# Altium project TE0723.PrjPCB (part 1 of 2)
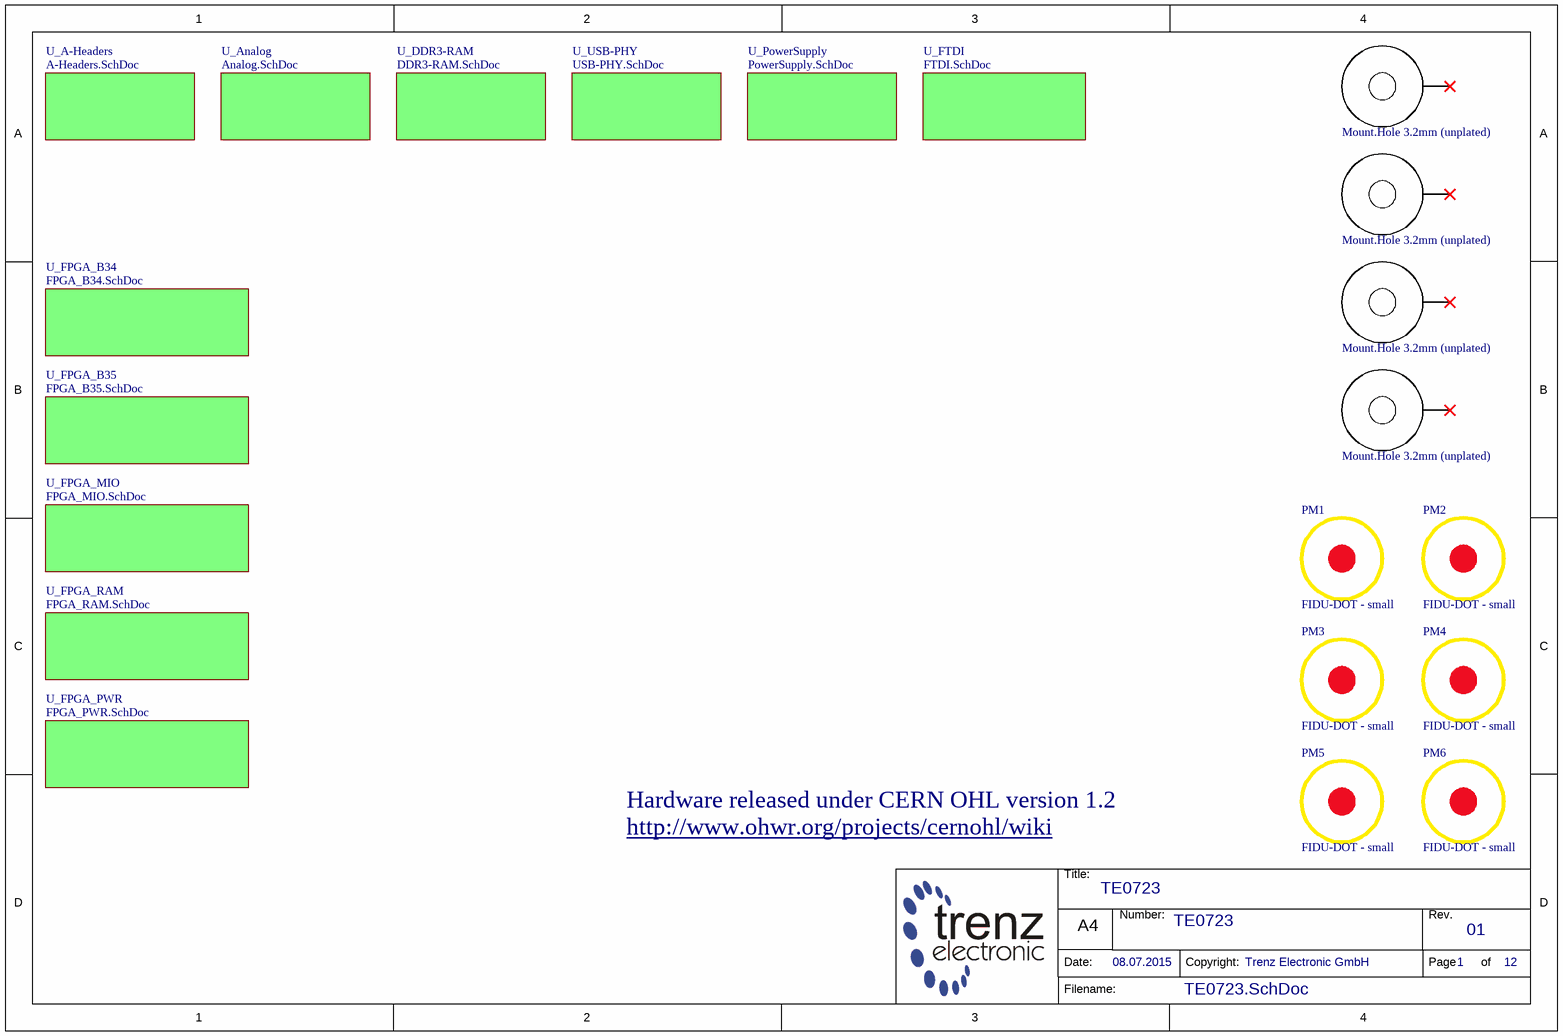
[diagram p0: TE0723.SchDoc]
12 sheets, 204 parts. Net scope: global (net labels, ports and power ports of the same name join across sheets).
Board file: TE0723.PcbDoc
Sheets:
  TE0723.SchDoc
    U_A-Headers = A-Headers.SchDoc
    U_Analog = Analog.SchDoc
    U_DDR3-RAM = DDR3-RAM.SchDoc
    U_FPGA_B34 = FPGA_B34.SchDoc
    U_FPGA_B35 = FPGA_B35.SchDoc
    U_FPGA_MIO = FPGA_MIO.SchDoc
    U_FPGA_PWR = FPGA_PWR.SchDoc
    U_FPGA_RAM = FPGA_RAM.SchDoc
    U_FTDI = FTDI.SchDoc
    U_PowerSupply = PowerSupply.SchDoc
    U_USB-PHY = USB-PHY.SchDoc

## Sheet TE0723.SchDoc: TE0723
size A4; Organization: Trenz Electronic GmbH; DocumentNumber: TE0723; Revision: 01; SheetNumber: 1; SheetTotal: 12; Date: 08.07.2015; Author: Indrek Tubalkain; CompanyName: Trenz Electronic GmbH; DrawnBy: Indrek Tubalkain; Engineer: Indrek Tubalkain; ProjectName: TE0723 Arduino

### Parts
H1  Mount.Hole 3.2mm (unplated)  [MHole3_2mm-UNPLATED]  (no BOM)
H2  Mount.Hole 3.2mm (unplated)  [MHole3_2mm-UNPLATED]  (no BOM)
H3  Mount.Hole 3.2mm (unplated)  [MHole3_2mm-UNPLATED]  (no BOM)
H4  Mount.Hole 3.2mm (unplated)  [MHole3_2mm-UNPLATED]  (no BOM)
PM1  FIDU-DOT - small  [FIDU-DOT - small]
PM2  FIDU-DOT - small  [FIDU-DOT - small]
PM3  FIDU-DOT - small  [FIDU-DOT - small]
PM4  FIDU-DOT - small  [FIDU-DOT - small]
PM5  FIDU-DOT - small  [FIDU-DOT - small]
PM6  FIDU-DOT - small  [FIDU-DOT - small]

### Sub-sheets
U_A-Headers = A-Headers.SchDoc: no entries
U_Analog = Analog.SchDoc: no entries
U_DDR3-RAM = DDR3-RAM.SchDoc: no entries
U_FPGA_B34 = FPGA_B34.SchDoc: no entries
U_FPGA_B35 = FPGA_B35.SchDoc: no entries
U_FPGA_MIO = FPGA_MIO.SchDoc: no entries
U_FPGA_PWR = FPGA_PWR.SchDoc: no entries
U_FPGA_RAM = FPGA_RAM.SchDoc: no entries
U_FTDI = FTDI.SchDoc: no entries
U_PowerSupply = PowerSupply.SchDoc: no entries
U_USB-PHY = USB-PHY.SchDoc: no entries

### Nets

Not connected (* = marked no-connect by the designer): H1 1*; H2 1*; H3 1*; H4 1*

### Notes on the sheet
- Hardware released under CERN OHL version 1.2
- http://www.ohwr.org/projects/cernohl/wiki
- Title:
- Number:
- Rev.
- Date:
- A4
- Copyright:
- Page
- of
- Filename:

### Library data of the parts
H1-H4 = 24910: AN: 24910; Mixed: THT
PM1-PM6 = 22905: AN: 22905; Mixed: FIDU

## Sheet A-Headers.SchDoc: TE0723 - Connectors
size A4; Organization: Trenz Electronic GmbH; DocumentNumber: TE0723; Revision: 01; SheetNumber: 12; SheetTotal: 12; Date: 08.07.2015; Author: Indrek Tubalkain; CompanyName: Trenz Electronic GmbH; DrawnBy: Indrek Tubalkain; Engineer: Indrek Tubalkain; ProjectName: TE0723 Arduino
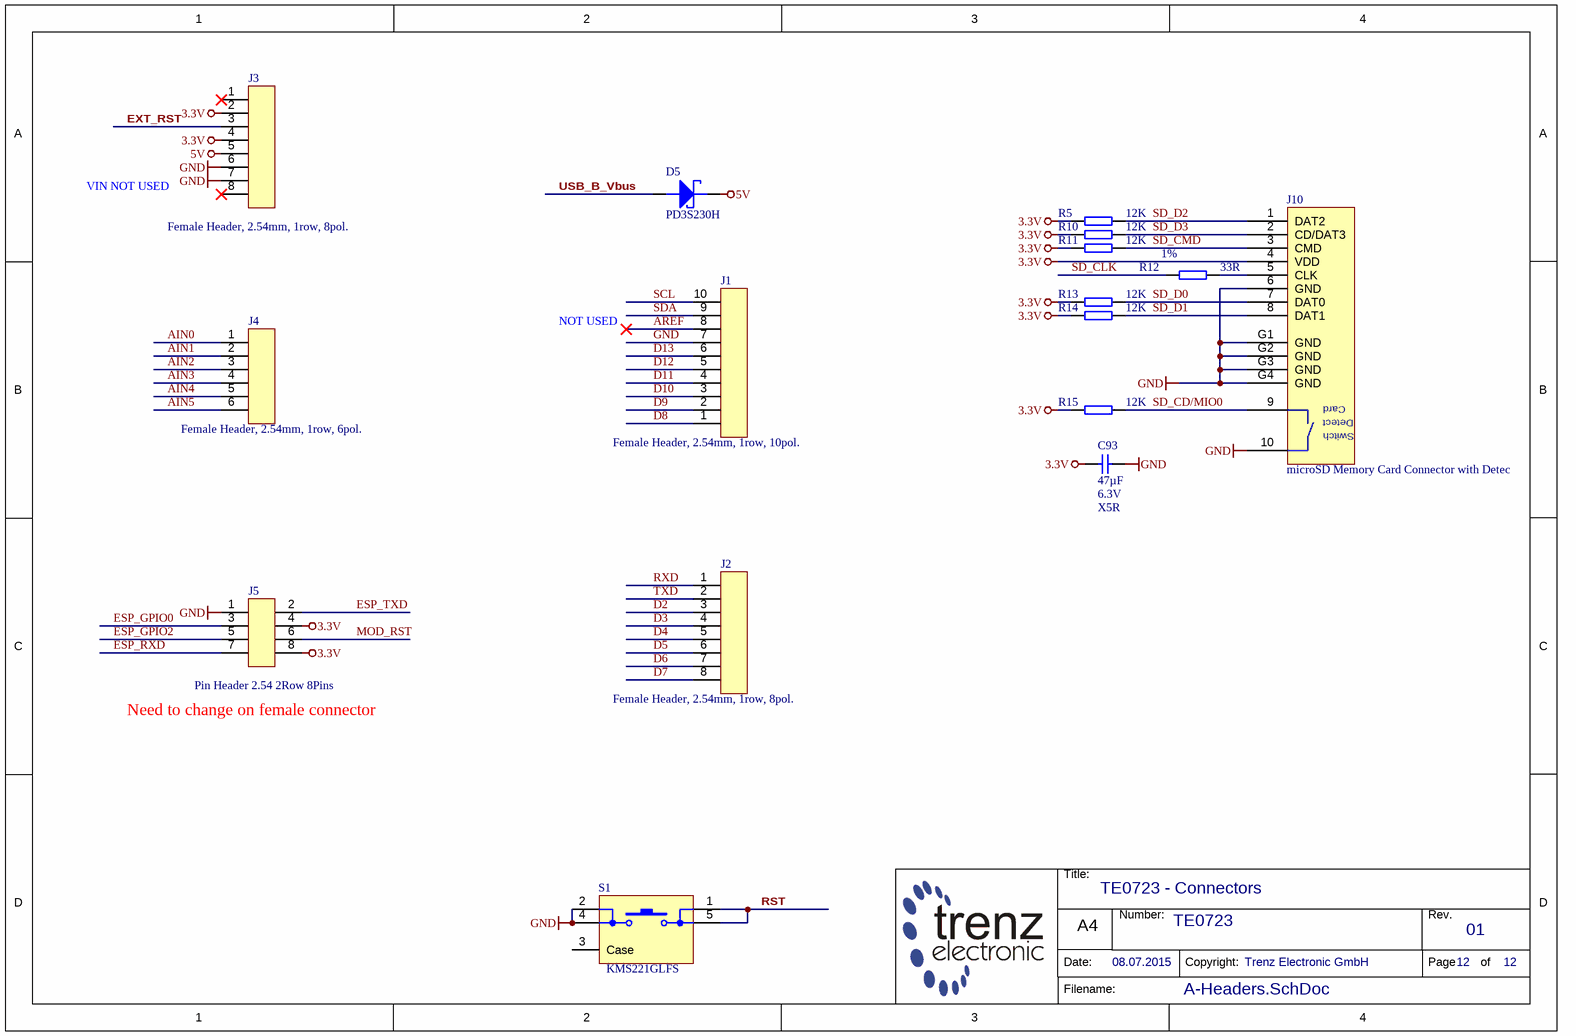
[diagram p1: A-Headers.SchDoc]

### Parts
C93  47µF  Voltage: 6.3V  Technology: X5R  [CAPC2012X135N]
D5  PD3S230H  [PowerDI323]
J1  Female Header, 2.54mm, 1row, 10pol.  [BUCHSENLEISTE-2.54-10-1R]
J2  Female Header, 2.54mm, 1row, 8pol.  [BUCHSENLEISTE-2.54-8-1R]
J3  Female Header, 2.54mm, 1row, 8pol.  [BUCHSENLEISTE-2.54-8-1R]
J4  Female Header, 2.54mm, 1row, 6pol.  [BUCHSENLEISTE-2.54-6-1R]
J5  Pin Header 2.54 2Row 8Pins  [STIFTLEISTE2_54 OG 2R-8]
J10  microSD Memory Card Connector with Detec  [104031-0811]
R5  12K  [RESC1005X40N]
R10  12K  [RESC1005X40N]
R11  12K  [RESC1005X40N]
R12  33R  Tolerance: 1%  [RESC0603X26N]
R13  12K  [RESC1005X40N]
R14  12K  [RESC1005X40N]
R15  12K  [RESC1005X40N]
S1  KMS221GLFS  [KMS2xxGLFS]

### Nets
3.3V: C93.1 J3.2 J3.4 J5.4 J5.8 J10.4(VDD) R5.1 R10.1 R11.1 R13.1 R14.1 R15.1
5V: D5.1(KATHODE) J3.5
GND: C93.2 J1.7 J3.6 J3.7 J5.1 J10.6(GND) J10.10(CDSW) J10.G1(GND) J10.G2(GND) J10.G3(GND) J10.G4(GND) S1.2 S1.4
AIN0: J4.1
AIN1: J4.2
AIN2: J4.3
AIN3: J4.4
AIN4: J4.5
AIN5: J4.6
AREF: J1.8
D2: J2.3
D3: J2.4
D4: J2.5
D5: J2.6
D6: J2.7
D7: J2.8
D8: J1.1
D9: J1.2
D10: J1.3
D11: J1.4
D12: J1.5
D13: J1.6
ESP_GPIO0: J5.3
ESP_GPIO2: J5.5
ESP_RXD: J5.7
ESP_TXD: J5.2
EXT_RST: J3.3
MOD_RST: J5.6
RST: S1.1 S1.5
RXD: J2.1
SCL: J1.10
SD_CD/MIO0: J10.9(CDSW) R15.2
SD_CLK: R12.1
SD_CMD: J10.3(CMD) R11.2
SD_D0: J10.7(DAT0) R13.2
SD_D1: J10.8(DAT1) R14.2
SD_D2: J10.1(DAT2) R5.2
SD_D3: J10.2(CD/DAT3) R10.2
SDA: J1.9
TXD: J2.2
USB_B_Vbus: D5.2(ANODE)
NetJ10_5: J10.5(CLK) R12.2

Not connected (* = marked no-connect by the designer): J3 1* 8*; S1 3(Case)

### Notes on the sheet
- VIN NOT USED
- NOT USED
- (near J5) Need to change on female connector
- Title:
- Number:
- Rev.
- Date:
- A4
- Copyright:
- Page
- of
- Filename:
- (in symbol 26322) Card; Detect; Switch

### Library data of the parts
C93 = 24718: KON 47µF 6,3V  X5R SMD 20%; AN: 24718; Mixed: SMT; Value: 47u; Preferred: Yes; Case: 2012 (0805); Tolerance: 20%
D5 = 24682: AN: 24682; Mixed: SMT; Case: PowerDI323; HelpURL: B:\AD\adlib\datasheet\PD3S230H
J1 = 26386: Buchsenleiste 1 reihig präz. 10 pol.; AN: 26386; Mixed: THT
J2 J3 = 26387: Buchsenleiste 1 reihig präz. 8 pol.; AN: 26387; Mixed: THT
J4 = 26388: Buchsenleiste 1 reihig präz. 6 pol.; AN: 26388; Mixed: THT
J5 = 23904: Stiftleiste gerade 2-reihig, 8pol.; AN: 23904; Mixed: THT; Trenz-Stock: Yes
J10 = 26322: microSD Memory Card Connector with Detect Switch; AN: 26322; Mixed: SMT; Trenz-Stock: Yes; Case: microSD; HelpURL: B:\AD\adlib\datasheet\104031-0811
R5 R10 R11 R13-R15 = 22598: WID SMD 12K 1% 0,063W; AN: 22598; Mixed: SMT; Preferred: Yes; Case: 1005 (0402); Value: 12K
R12 = 25021: WID SMD 33R 1% 0,05W; AN: 25021; Mixed: SMT; Value: 33; Preferred: Yes; Case: 0603 (0201); HelpURL: B:\AD\adlib\datasheet\R0201
S1 = 26229: KMS221GLFS - SWITCH, SPST, 0.05A, 32VDC, SMD; AN: 26229; Mixed: SMT; HelpURL: B:\AD\adlib\datasheet\KMS

## Sheet Analog.SchDoc: TE0723 - Analog Input
size A4; PageSetup: Record=PageOptions|CenterHorizontal=True|CenterVertical=True|PrintScale=0.96|XCorrection=1.00|YCorrection=1.00|PrintKind=0|BorderSize=5000000|LeftOffset=0|BottomOffset=0|Orientation=2|PaperLength=1000|PaperWidth=1000|Scale=100|PaperSource=7|PrintQuality=-4|MediaType=1|DitherType=10|PaperKind=A4|PrintScaleMode=1; Organization: Trenz Electronic GmbH; DocumentNumber: TE0723; Revision: 01; SheetNumber: 7; SheetTotal: 12; Date: 08.07.2015; Author: Indrek Tubalkain; CompanyName: Trenz Electronic GmbH; DrawnBy: Indrek Tubalkain; Engineer: Indrek Tubalkain; ProjectName: TE0723 Arduino
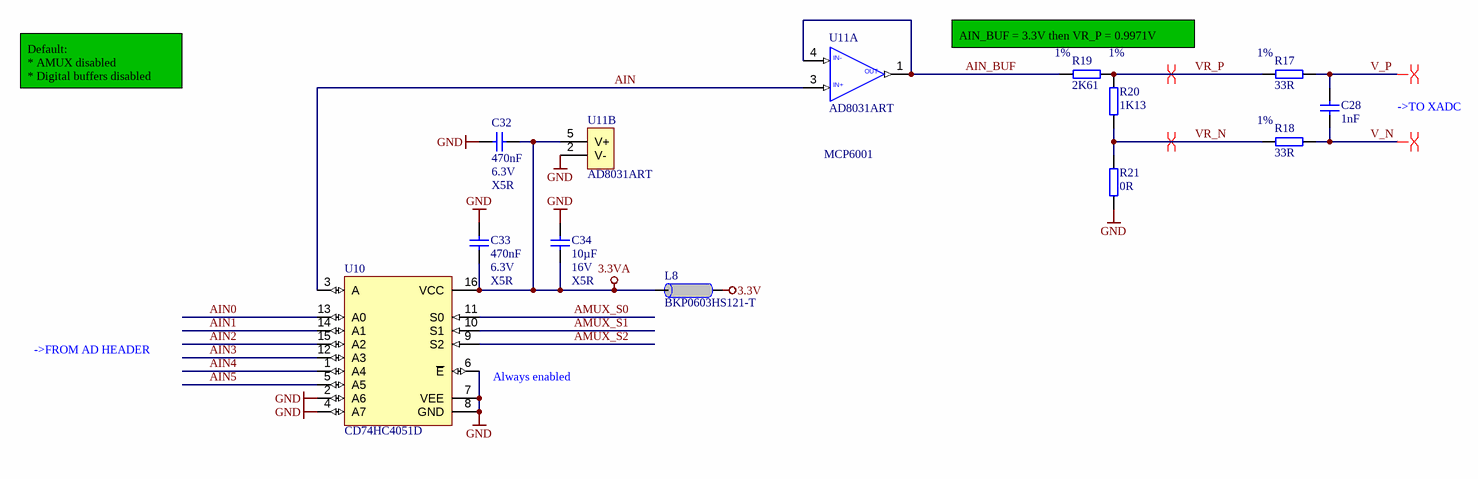
[diagram p2: Analog.SchDoc]

### Parts
C28  1nF  [CAPC1005X55N]
C32  470nF  Voltage: 6.3V  Technology: X5R  [CAPC0603X33N]
C33  470nF  Voltage: 6.3V  Technology: X5R  [CAPC0603X33N]
C34  10µF  Voltage: 16V  Technology: X5R  [CAPC1608X90N]
L8  BKP0603HS121-T  [INDC0603X33N]
R17  33R  Tolerance: 1%  [RESC0603X26N]
R18  33R  Tolerance: 1%  [RESC0603X26N]
R19  2K61  Tolerance: 1%  [RESC1005X40N]
R20  1K13  Tolerance: 1%  [RESC1005X40N]
R21  0R  [RESC1005X40N]
U10  CD74HC4051D  [SOIC127P600X175-16N]
U11  AD8031ART  [SOT95P280X145-5N]  (parts A,B of 2)

### Nets
3.3V: L8.1
3.3VA: C32.2 C33.1 C34.2 L8.2 U10.16(VCC) U11.5(V+)
GND: C32.1 C33.2 C34.1 R21.2 U10.2(A6) U10.4(A7) U10.6(~{E}) U10.7(VEE) U10.8(GND) U11.2(V-)
AIN: U10.3(A) U11.3(IN+)
AIN0: U10.13(A0)
AIN1: U10.14(A1)
AIN2: U10.15(A2)
AIN3: U10.12(A3)
AIN4: U10.1(A4)
AIN5: U10.5(A5)
AIN_BUF: R19.1 U11.1(OUT) U11.4(IN-)
AMUX_S0: U10.11(S0)
AMUX_S1: U10.10(S1)
AMUX_S2: U10.9(S2)
V_N: C28.2 R18.2
V_P: C28.1 R17.2
VR_N: R18.1 R20.2 R21.1
VR_P: R17.1 R19.2 R20.1

### Layout directives
differential pair: V_N, V_P, VR_N, VR_P

### Notes on the sheet
- AIN_BUF = 3.3V then VR_P = 0.9971V
- Default:
  * AMUX disabled
  * Digital buffers disabled
- ->TO XADC
- MCP6001
- ->FROM AD HEADER
- (near U10) Always enabled
- Title:
- Number:
- Rev.
- Date:
- A4
- Copyright:
- Page
- of
- Filename:

### Library data of the parts
C28 = 26184: KON 1nF 50V SMD AEC-Q200; AN: 26184; Tolerance: 10%; Mixed: SMT; Value: 1n; Case: 1005 (0402); Voltage: 50V; Technology: X7R
C32 C33 = 24921: KON 470nF X5R 6.3V SMD 20%; AN: 24921; Value: 470n; Mixed: SMT; Preferred: Yes; Case: 0603 (0201); Tolerance: 20%
C34 = 25341: KON 10µF 16V X5R SMD 20%; AN: 25341; Mixed: SMT; Value: 10u; Preferred: Yes; Case: 1608 (0603); Tolerance: 20%
L8 = 25393: Ferritdurchführung SMD 0201; AN: 25393; Mixed: SMT; Trenz-Stock: Yes; Tolerance: 25%; Case: 0603 (0201); HelpURL: B:\AD\adlib\datasheet\MULTILAYER CHIP BEAD INDUCTORS BK; Preferred: Yes
R17 R18 = 25021: as R12 on sheet A-Headers; Case: 0603 (0201); HelpURL: B:\AD\adlib\datasheet\R0201
R19 = 23730: WID SMD 2K61 1% 0,063W; AN: 23730; Mixed: SMT; Value: 2.61K; Preferred: Yes; Case: 1005 (0402)
R20 = 23160: WID SMD 1K13 1% 0,063W; AN: 23160; Mixed: SMT; Value: 1.13K; Preferred: Yes; Case: 1005 (0402)
R21 = 26222: WID SMD 0R 1% 0.063W AEC-Q200; AN: 26222; Mixed: SMT; Value: 0; Preferred: Yes; Case: 1005 (0402)
U10 = 26538: AN: 26538; Mixed: SMT; Trenz-Stock: Yes; Case: SOIC16 D (R-PDSO-G16); HelpURL: B:\AD\adlib\datasheet\74HCx4051
U11 = 25377: AN: 25377; Mixed: SMT; Trenz-Stock: Yes; Case: SOT23-5; HelpURL: B:\AD\adlib\datasheet\AD8031

## Sheet DDR3-RAM.SchDoc: TE0723 - DDR Memory
size A4; Organization: Trenz Electronic GmbH; DocumentNumber: TE0723; Revision: 01; SheetNumber: 8; SheetTotal: 12; Date: 08.07.2015; Author: Indrek Tubalkain; CompanyName: Trenz Electronic GmbH; DrawnBy: Indrek Tubalkain; Engineer: Indrek Tubalkain; ProjectName: TE0723 Arduino
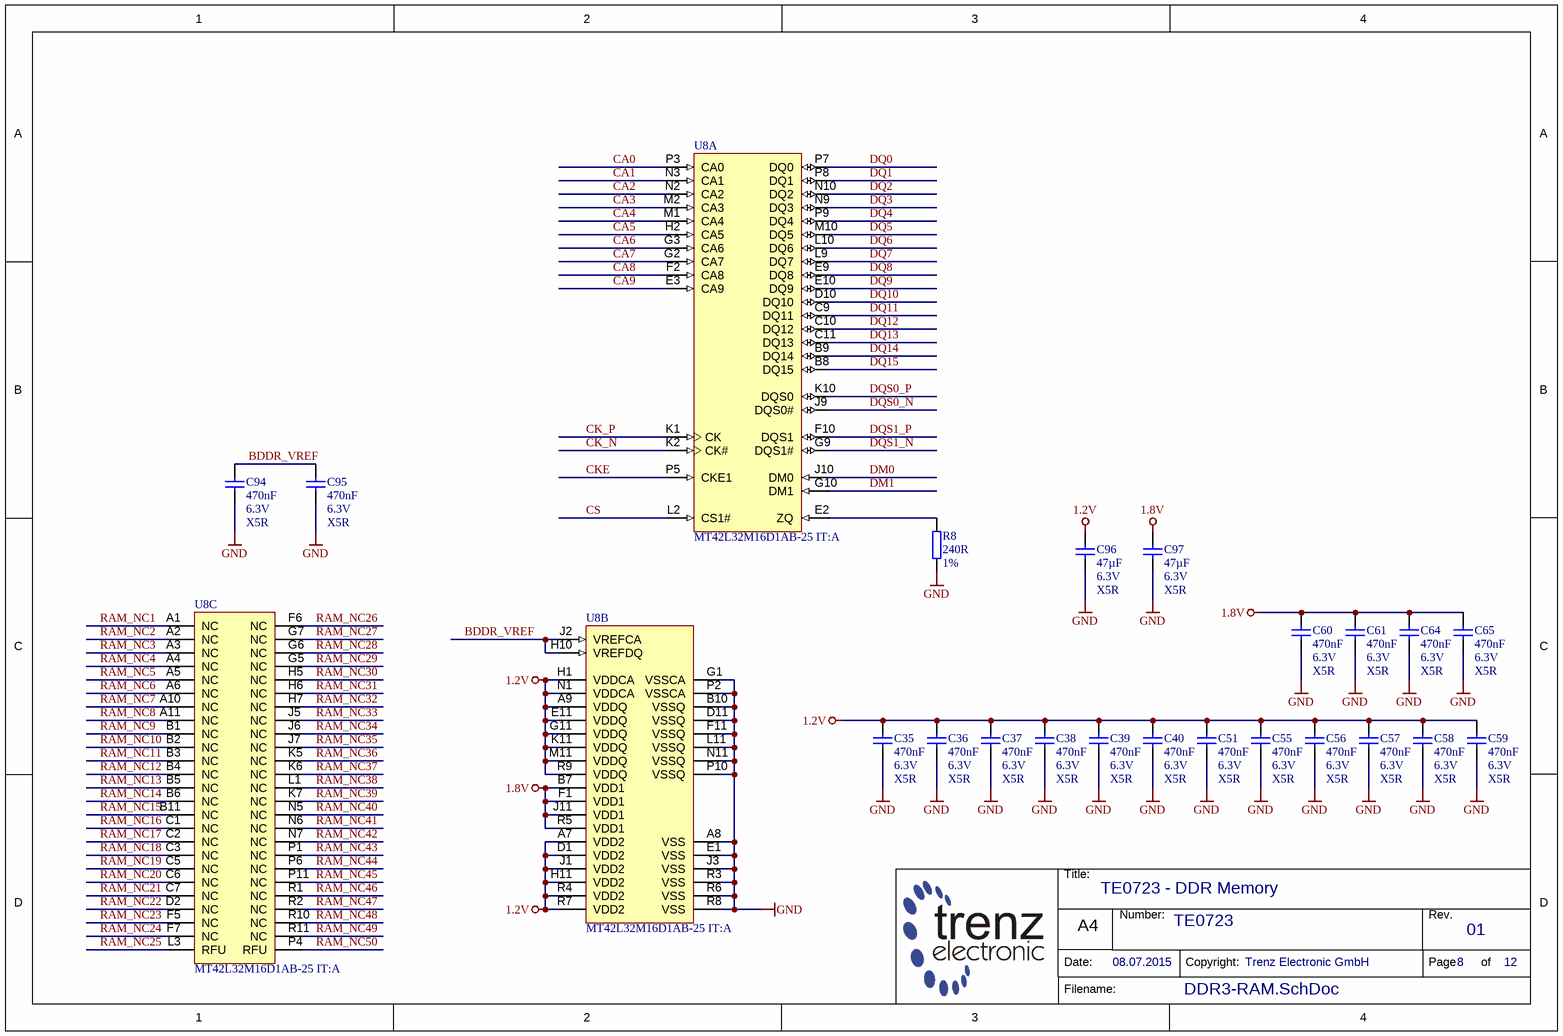
[diagram p3: DDR3-RAM.SchDoc]

### Parts
C35  470nF  Voltage: 6.3V  Technology: X5R  [CAPC0603X33N]
C36  470nF  Voltage: 6.3V  Technology: X5R  [CAPC0603X33N]
C37  470nF  Voltage: 6.3V  Technology: X5R  [CAPC0603X33N]
C38  470nF  Voltage: 6.3V  Technology: X5R  [CAPC0603X33N]
C39  470nF  Voltage: 6.3V  Technology: X5R  [CAPC0603X33N]
C40  470nF  Voltage: 6.3V  Technology: X5R  [CAPC0603X33N]
C51  470nF  Voltage: 6.3V  Technology: X5R  [CAPC0603X33N]
C55  470nF  Voltage: 6.3V  Technology: X5R  [CAPC0603X33N]
C56  470nF  Voltage: 6.3V  Technology: X5R  [CAPC0603X33N]
C57  470nF  Voltage: 6.3V  Technology: X5R  [CAPC0603X33N]
C58  470nF  Voltage: 6.3V  Technology: X5R  [CAPC0603X33N]
C59  470nF  Voltage: 6.3V  Technology: X5R  [CAPC0603X33N]
C60  470nF  Voltage: 6.3V  Technology: X5R  [CAPC0603X33N]
C61  470nF  Voltage: 6.3V  Technology: X5R  [CAPC0603X33N]
C64  470nF  Voltage: 6.3V  Technology: X5R  [CAPC0603X33N]
C65  470nF  Voltage: 6.3V  Technology: X5R  [CAPC0603X33N]
C94  470nF  Voltage: 6.3V  Technology: X5R  [CAPC0603X33N]
C95  470nF  Voltage: 6.3V  Technology: X5R  [CAPC0603X33N]
C96  47µF  Voltage: 6.3V  Technology: X5R  [CAPC2012X135N]
C97  47µF  Voltage: 6.3V  Technology: X5R  [CAPC2012X135N]
R8  240R  Tolerance: 1%  [RESC1005X40N]
U8  MT42L32M16D1AB-25 IT:A  [BGA121C50P15X11_800X650X80B32N]  (parts A,B,C of 3)

### Nets
1.2V: C35.1 C36.1 C37.1 C38.1 C39.1 C40.1 C51.1 C55.1 C56.1 C57.1 C58.1 C59.1 C96.1 U8.A7(VDD2) U8.A9(VDDQ) U8.D1(VDD2) U8.E11(VDDQ) U8.G11(VDDQ) U8.H1(VDDCA) U8.H11(VDD2) U8.J1(VDD2) U8.K11(VDDQ) U8.M11(VDDQ) U8.N1(VDDCA) U8.R4(VDD2) U8.R7(VDD2) U8.R9(VDDQ)
1.8V: C60.1 C61.1 C64.1 C65.1 C97.1 U8.B7(VDD1) U8.F1(VDD1) U8.J11(VDD1) U8.R5(VDD1)
GND: C35.2 C36.2 C37.2 C38.2 C39.2 C40.2 C51.2 C55.2 C56.2 C57.2 C58.2 C59.2 C60.2 C61.2 C64.2 C65.2 C94.2 C95.2 C96.2 C97.2 R8.2 U8.A8(VSS) U8.B10(VSSQ) U8.D11(VSSQ) U8.E1(VSS) U8.F11(VSSQ) U8.G1(VSSCA) U8.J3(VSS) U8.L11(VSSQ) U8.N11(VSSQ) U8.P2(VSSCA) U8.P10(VSSQ) U8.R3(VSS) U8.R6(VSS) U8.R8(VSS)
BDDR_VREF: C94.1 C95.1 U8.H10(VREFDQ) U8.J2(VREFCA)
CA0: U8.P3(CA0)
CA1: U8.N3(CA1)
CA2: U8.N2(CA2)
CA3: U8.M2(CA3)
CA4: U8.M1(CA4)
CA5: U8.H2(CA5)
CA6: U8.G3(CA6)
CA7: U8.G2(CA7)
CA8: U8.F2(CA8)
CA9: U8.E3(CA9)
CK_N: U8.K2(CK#)
CK_P: U8.K1(CK)
CKE: U8.P5(CKE1)
CS: U8.L2(CS1#)
DM0: U8.J10(DM0)
DM1: U8.G10(DM1)
DQ0: U8.P7(DQ0)
DQ1: U8.P8(DQ1)
DQ2: U8.N10(DQ2)
DQ3: U8.N9(DQ3)
DQ4: U8.P9(DQ4)
DQ5: U8.M10(DQ5)
DQ6: U8.L10(DQ6)
DQ7: U8.L9(DQ7)
DQ8: U8.E9(DQ8)
DQ9: U8.E10(DQ9)
DQ10: U8.D10(DQ10)
DQ11: U8.C9(DQ11)
DQ12: U8.C10(DQ12)
DQ13: U8.C11(DQ13)
DQ14: U8.B9(DQ14)
DQ15: U8.B8(DQ15)
DQS0_N: U8.J9(DQS0#)
DQS0_P: U8.K10(DQS0)
DQS1_N: U8.G9(DQS1#)
DQS1_P: U8.F10(DQS1)
RAM_NC1: U8.A1(NC)
RAM_NC2: U8.A2(NC)
RAM_NC3: U8.A3(NC)
RAM_NC4: U8.A4(NC)
RAM_NC5: U8.A5(NC)
RAM_NC6: U8.A6(NC)
RAM_NC7: U8.A10(NC)
RAM_NC8: U8.A11(NC)
RAM_NC9: U8.B1(NC)
RAM_NC10: U8.B2(NC)
RAM_NC11: U8.B3(NC)
RAM_NC12: U8.B4(NC)
RAM_NC13: U8.B5(NC)
RAM_NC14: U8.B6(NC)
RAM_NC15: U8.B11(NC)
RAM_NC16: U8.C1(NC)
RAM_NC17: U8.C2(NC)
RAM_NC18: U8.C3(NC)
RAM_NC19: U8.C5(NC)
RAM_NC20: U8.C6(NC)
RAM_NC21: U8.C7(NC)
RAM_NC22: U8.D2(NC)
RAM_NC23: U8.F5(NC)
RAM_NC24: U8.F7(NC)
RAM_NC25: U8.L3(RFU)
RAM_NC26: U8.F6(NC)
RAM_NC27: U8.G7(NC)
RAM_NC28: U8.G6(NC)
RAM_NC29: U8.G5(NC)
RAM_NC30: U8.H5(NC)
RAM_NC31: U8.H6(NC)
RAM_NC32: U8.H7(NC)
RAM_NC33: U8.J5(NC)
RAM_NC34: U8.J6(NC)
RAM_NC35: U8.J7(NC)
RAM_NC36: U8.K5(NC)
RAM_NC37: U8.K6(NC)
RAM_NC38: U8.L1(NC)
RAM_NC39: U8.K7(NC)
RAM_NC40: U8.N5(NC)
RAM_NC41: U8.N6(NC)
RAM_NC42: U8.N7(NC)
RAM_NC43: U8.P1(NC)
RAM_NC44: U8.P6(NC)
RAM_NC45: U8.P11(NC)
RAM_NC46: U8.R1(NC)
RAM_NC47: U8.R2(NC)
RAM_NC48: U8.R10(NC)
RAM_NC49: U8.R11(NC)
RAM_NC50: U8.P4(RFU)
NetR8_1: R8.1 U8.E2(ZQ)

### Notes on the sheet
- Title:
- Number:
- Rev.
- Date:
- A4
- Copyright:
- Page
- of
- Filename:

### Library data of the parts
C35-C40 C51 C55-C61 C64 C65 C94 C95 = 24921: KON 470nF X5R 6.3V SMD 20%; AN: 24921; Mixed: SMT; Value: 470n; Preferred: Yes; Case: 0603 (0201); Tolerance: 20%
C96 C97 = 24718: as C93 on sheet A-Headers; Case: 2012 (0805); Tolerance: 20%
R8 = 23661: WID SMD 240R 1% 0,063W; AN: 23661; Mixed: SMT; Value: 240; Preferred: Yes; Case: 1005 (0402)
U8 = 26300: AN: 26300; Mixed: SMT; Case: BGA121; HelpURL: B:\AD\adlib\datasheet\MT42LxxMxxD1

## Sheet FPGA_B34.SchDoc: TE0723 - FPGA B34
size A4; PageSetup: Record=PageOptions|CenterHorizontal=True|CenterVertical=True|PrintScale=0.96|XCorrection=1.00|YCorrection=1.00|PrintKind=0|BorderSize=5000000|LeftOffset=0|BottomOffset=0|Orientation=2|PaperLength=1000|PaperWidth=1000|Scale=100|PaperSource=7|PrintQuality=-4|MediaType=1|DitherType=10|PaperKind=A4|PrintScaleMode=1; Organization: Trenz Electronic GmbH; DocumentNumber: TE0723; Revision: 01; SheetNumber: 2; SheetTotal: 12; Date: 08.07.2015; Author: Indrek Tubalkain; CompanyName: Trenz Electronic GmbH; DrawnBy: Indrek Tubalkain; Engineer: Indrek Tubalkain; ProjectName: TE0723 Arduino
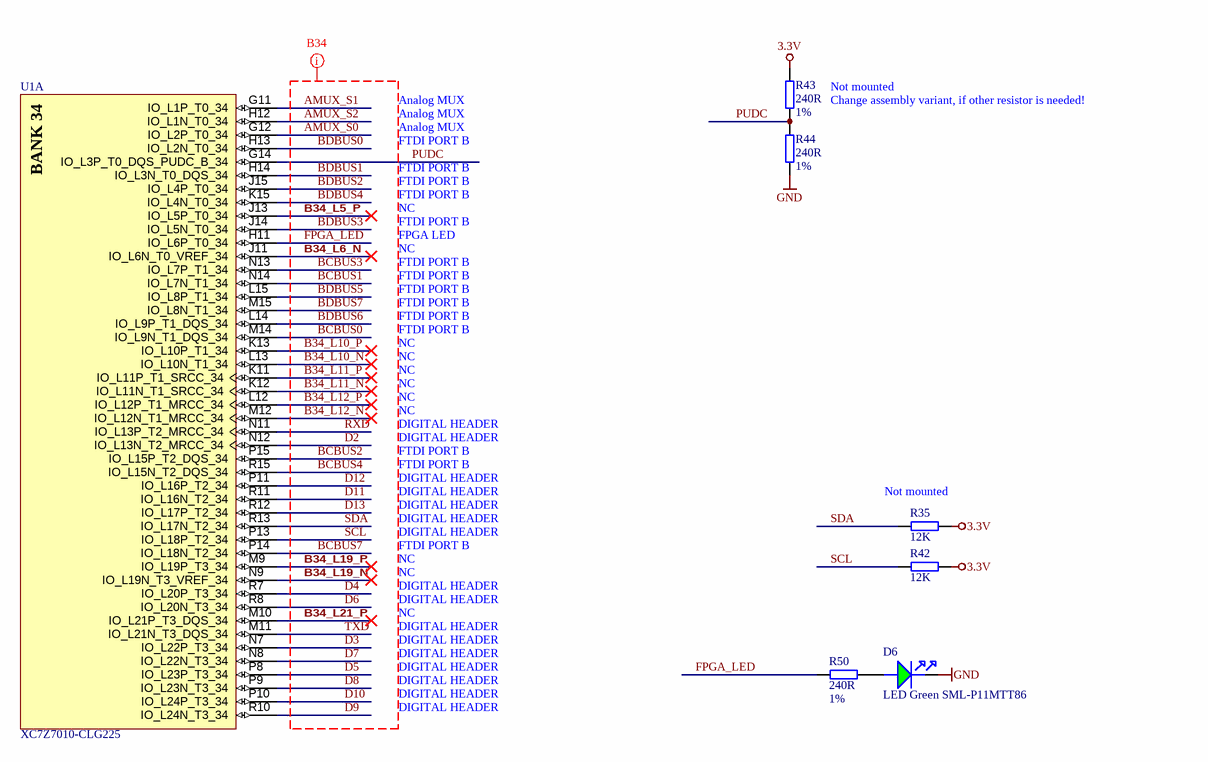
[diagram p4: FPGA_B34.SchDoc]

### Parts
D6  LED Green SML-P11MTT86  [LEDC1006X25N_GREEN]
R35  12K  [RESC1005X40N]
R42  12K  [RESC1005X40N]
R43  240R  Tolerance: 1%  [RESC1005X40N]
R44  240R  Tolerance: 1%  [RESC1005X40N]
R50  240R  Tolerance: 1%  [RESC1005X40N]
U1  XC7Z7010-CLG225  (part A of 8)

### Nets
3.3V: R35.2 R42.2 R43.1
GND: D6.K R44.2
AMUX_S0: U1.G12(IO_L2P_T0_34)
AMUX_S1: U1.G11(IO_L1P_T0_34)
AMUX_S2: U1.H12(IO_L1N_T0_34)
B34_L5_P: U1.J13(IO_L5P_T0_34)
B34_L6_N: U1.J11(IO_L6N_T0_VREF_34)
B34_L10_N: U1.L13(IO_L10N_T1_34)
B34_L10_P: U1.K13(IO_L10P_T1_34)
B34_L11_N: U1.K12(IO_L11N_T1_SRCC_34)
B34_L11_P: U1.K11(IO_L11P_T1_SRCC_34)
B34_L12_N: U1.M12(IO_L12N_T1_MRCC_34)
B34_L12_P: U1.L12(IO_L12P_T1_MRCC_34)
B34_L19_N: U1.N9(IO_L19N_T3_VREF_34)
B34_L19_P: U1.M9(IO_L19P_T3_34)
B34_L21_P: U1.M10(IO_L21P_T3_DQS_34)
BCBUS0: U1.M14(IO_L9N_T1_DQS_34)
BCBUS1: U1.N14(IO_L7N_T1_34)
BCBUS2: U1.P15(IO_L15P_T2_DQS_34)
BCBUS3: U1.N13(IO_L7P_T1_34)
BCBUS4: U1.R15(IO_L15N_T2_DQS_34)
BCBUS7: U1.P14(IO_L18N_T2_34)
BDBUS0: U1.H13(IO_L2N_T0_34)
BDBUS1: U1.H14(IO_L3N_T0_DQS_34)
BDBUS2: U1.J15(IO_L4P_T0_34)
BDBUS3: U1.J14(IO_L5N_T0_34)
BDBUS4: U1.K15(IO_L4N_T0_34)
BDBUS5: U1.L15(IO_L8P_T1_34)
BDBUS6: U1.L14(IO_L9P_T1_DQS_34)
BDBUS7: U1.M15(IO_L8N_T1_34)
D2: U1.N12(IO_L13N_T2_MRCC_34)
D3: U1.N7(IO_L22P_T3_34)
D4: U1.R7(IO_L20P_T3_34)
D5: U1.P8(IO_L23P_T3_34)
D6: U1.R8(IO_L20N_T3_34)
D7: U1.N8(IO_L22N_T3_34)
D8: U1.P9(IO_L23N_T3_34)
D9: U1.R10(IO_L24N_T3_34)
D10: U1.P10(IO_L24P_T3_34)
D11: U1.R11(IO_L16N_T2_34)
D12: U1.P11(IO_L16P_T2_34)
D13: U1.R12(IO_L17P_T2_34)
FPGA_LED: R50.2 U1.H11(IO_L6P_T0_34)
PUDC: R43.2 R44.1 U1.G14(IO_L3P_T0_DQS_PUDC_B_34)
RXD: U1.N11(IO_L13P_T2_MRCC_34)
SCL: R42.1 U1.P13(IO_L18P_T2_34)
SDA: R35.1 U1.R13(IO_L17N_T2_34)
TXD: U1.M11(IO_L21N_T3_DQS_34)
NetD6_A: D6.A R50.1

### Layout directives
net class B34: AMUX_S0, AMUX_S1, AMUX_S2, B34_L5_P, B34_L6_N, B34_L10_N, B34_L10_P, B34_L11_N, B34_L11_P, B34_L12_N, B34_L12_P, B34_L19_N, B34_L19_P, B34_L21_P, BCBUS0, BCBUS1, BCBUS2, BCBUS3, BCBUS4, BCBUS7, BDBUS0, BDBUS1, BDBUS2, BDBUS3, BDBUS4, BDBUS5, BDBUS6, BDBUS7, D2, D3, D4, D5, D6, D7, D8, D9, D10, D11, D12, D13, FPGA_LED, RXD, SCL, SDA, TXD

### Notes on the sheet
- FTDI PORT B
- Analog MUX
- Not mounted
- Change assembly variant, if other resistor is needed!
- NC
- FPGA LED
- DIGITAL HEADER
- (near R35) Not mounted
- Title:
- Number:
- Rev.
- Date:
- A4
- Copyright:
- Page
- of
- Filename:
- (in symbol XC7Z7010-CLG225, part A) BANK 34

### Library data of the parts
D6 = 24211: LED Grün SML-P11MTT86 SMD; AN: 24211; Mixed: SMT; Preferred: Yes; Case: 1005 (0402); HelpURL: B:\AD\adlib\datasheet\SML-P1
R35 R42 = 22598: as R5 on sheet A-Headers; Case: 1005 (0402); Value: 12K
R43 R44 R50 = 23661: as R8 on sheet DDR3-RAM; Case: 1005 (0402)

## Sheet FPGA_B35.SchDoc: TE0723 - FPGA B35
size A4; PageSetup: Record=PageOptions|CenterHorizontal=True|CenterVertical=True|PrintScale=0.96|XCorrection=1.00|YCorrection=1.00|PrintKind=0|BorderSize=5000000|LeftOffset=0|BottomOffset=0|Orientation=2|PaperLength=1000|PaperWidth=1000|Scale=100|PaperSource=7|PrintQuality=-4|MediaType=1|DitherType=10|PaperKind=A4|PrintScaleMode=1; Organization: Trenz Electronic GmbH; DocumentNumber: TE0723; Revision: 01; SheetNumber: 3; SheetTotal: 12; Date: 08.07.2015; Author: Indrek Tubalkain; CompanyName: Trenz Electronic GmbH; DrawnBy: Indrek Tubalkain; Engineer: Indrek Tubalkain; ProjectName: TE0723 Arduino
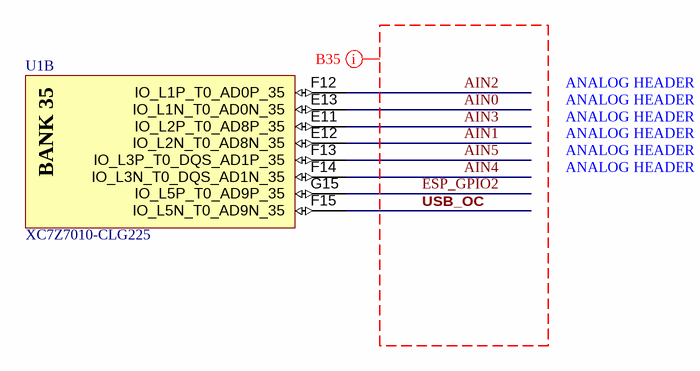
[diagram p5: FPGA_B35.SchDoc]

### Parts
U1  XC7Z7010-CLG225  (part B of 8)

### Nets
AIN0: U1.E13(IO_L1N_T0_AD0N_35)
AIN1: U1.E12(IO_L2N_T0_AD8N_35)
AIN2: U1.F12(IO_L1P_T0_AD0P_35)
AIN3: U1.E11(IO_L2P_T0_AD8P_35)
AIN4: U1.F14(IO_L3N_T0_DQS_AD1N_35)
AIN5: U1.F13(IO_L3P_T0_DQS_AD1P_35)
ESP_GPIO2: U1.G15(IO_L5P_T0_AD9P_35)
USB_OC: U1.F15(IO_L5N_T0_AD9N_35)

### Layout directives
net class B35: AIN0, AIN1, AIN2, AIN3, AIN4, AIN5, ESP_GPIO2, USB_OC

### Notes on the sheet
- ANALOG HEADER
- Title:
- Number:
- Rev.
- Date:
- A4
- Copyright:
- Page
- of
- Filename:
- (in symbol XC7Z7010-CLG225, part B) BANK 35

## Sheet FPGA_MIO.SchDoc: TE0723 - FPGA MIO
size A4; PageSetup: Record=PageOptions|CenterHorizontal=True|CenterVertical=True|PrintScale=0.96|XCorrection=1.00|YCorrection=1.00|PrintKind=0|BorderSize=5000000|LeftOffset=0|BottomOffset=0|Orientation=2|PaperLength=1000|PaperWidth=1000|Scale=100|PaperSource=7|PrintQuality=-4|MediaType=1|DitherType=10|PaperKind=A4|PrintScaleMode=1; Organization: Trenz Electronic GmbH; DocumentNumber: TE0723; Revision: 01; SheetNumber: 4; SheetTotal: 12; Date: 08.07.2015; Author: Indrek Tubalkain; CompanyName: Trenz Electronic GmbH; DrawnBy: Indrek Tubalkain; Engineer: Indrek Tubalkain; ProjectName: TE0723 Arduino
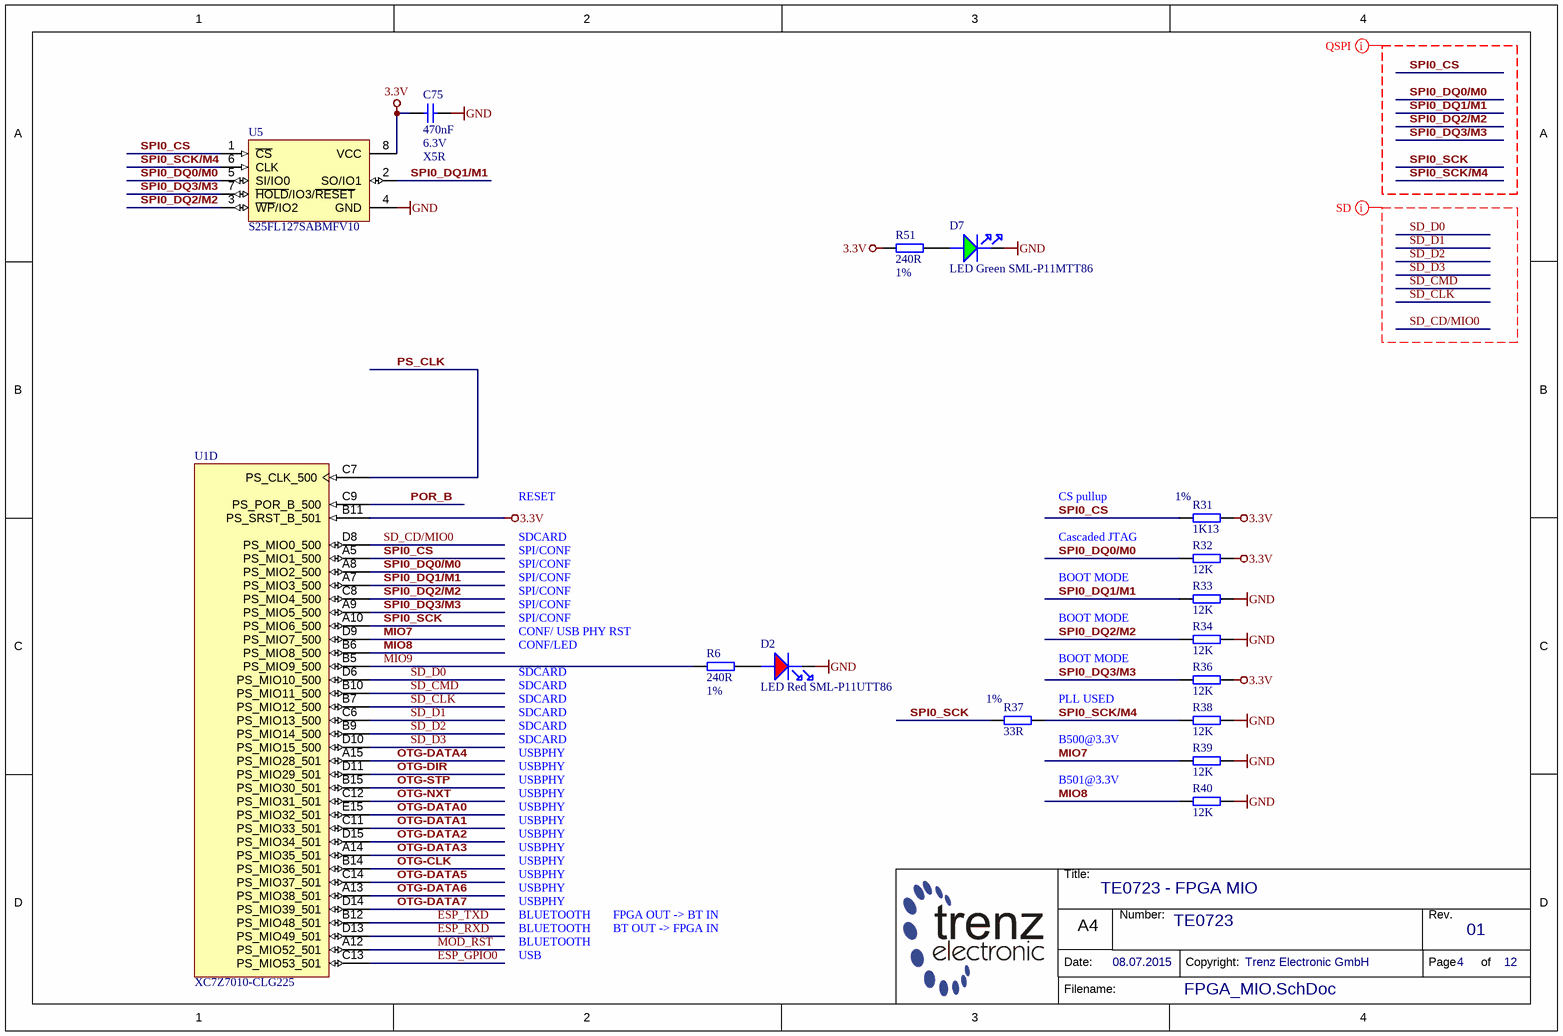
[diagram p6: FPGA_MIO.SchDoc]

### Parts
C75  470nF  Voltage: 6.3V  Technology: X5R  [CAPC0603X33N]
D2  LED Red SML-P11UTT86  [LEDC1006X25N_RED]
D7  LED Green SML-P11MTT86  [LEDC1006X25N_GREEN]
R6  240R  Tolerance: 1%  [RESC1005X40N]
R31  1K13  Tolerance: 1%  [RESC1005X40N]
R32  12K  [RESC1005X40N]
R33  12K  [RESC1005X40N]
R34  12K  [RESC1005X40N]
R36  12K  [RESC1005X40N]
R37  33R  Tolerance: 1%  [RESC0603X26N]
R38  12K  [RESC1005X40N]
R39  12K  [RESC1005X40N]
R40  12K  [RESC1005X40N]
R51  240R  Tolerance: 1%  [RESC1005X40N]
U1  XC7Z7010-CLG225  (part D of 8)
U5  S25FL127SABMFV10  [SOIC127P790X216-8N]

### Nets
3.3V: C75.1 R31.2 R32.2 R36.2 R51.2 U1.B11(PS_SRST_B_501) U5.8(VCC)
GND: C75.2 D2.K D7.K R33.2 R34.2 R38.2 R39.2 R40.2 U5.4(GND)
ESP_GPIO0: U1.C13(PS_MIO53_501)
ESP_RXD: U1.D13(PS_MIO49_501)
ESP_TXD: U1.B12(PS_MIO48_501)
MIO7: R39.1 U1.D9(PS_MIO7_500)
MIO8: R40.1 U1.B6(PS_MIO8_500)
MIO9: R6.2 U1.B5(PS_MIO9_500)
MOD_RST: U1.A12(PS_MIO52_501)
OTG-CLK: U1.B14(PS_MIO36_501)
OTG-DATA0: U1.E15(PS_MIO32_501)
OTG-DATA1: U1.C11(PS_MIO33_501)
OTG-DATA2: U1.D15(PS_MIO34_501)
OTG-DATA3: U1.A14(PS_MIO35_501)
OTG-DATA4: U1.A15(PS_MIO28_501)
OTG-DATA5: U1.C14(PS_MIO37_501)
OTG-DATA6: U1.A13(PS_MIO38_501)
OTG-DATA7: U1.D14(PS_MIO39_501)
OTG-DIR: U1.D11(PS_MIO29_501)
OTG-NXT: U1.C12(PS_MIO31_501)
OTG-STP: U1.B15(PS_MIO30_501)
POR_B: U1.C9(PS_POR_B_500)
PS_CLK: U1.C7(PS_CLK_500)
SD_CD/MIO0: U1.D8(PS_MIO0_500)
SD_CLK: U1.B7(PS_MIO12_500)
SD_CMD: U1.B10(PS_MIO11_500)
SD_D0: U1.D6(PS_MIO10_500)
SD_D1: U1.C6(PS_MIO13_500)
SD_D2: U1.B9(PS_MIO14_500)
SD_D3: U1.D10(PS_MIO15_500)
SPI0_CS: R31.1 U1.A5(PS_MIO1_500) U5.1(~{CS})
SPI0_DQ0/M0: R32.1 U1.A8(PS_MIO2_500) U5.5(SI/IO0)
SPI0_DQ1/M1: R33.1 U1.A7(PS_MIO3_500) U5.2(SO/IO1)
SPI0_DQ2/M2: R34.1 U1.C8(PS_MIO4_500) U5.3(~{WP}/IO2)
SPI0_DQ3/M3: R36.1 U1.A9(PS_MIO5_500) U5.7(~{HOLD}/IO3/~{RESET})
SPI0_SCK: R37.1 U1.A10(PS_MIO6_500)
SPI0_SCK/M4: R37.2 R38.1 U5.6(CLK)
NetD2_A: D2.A R6.1
NetD7_A: D7.A R51.1

### Layout directives
net class QSPI: SPI0_CS, SPI0_DQ0/M0, SPI0_DQ1/M1, SPI0_DQ2/M2, SPI0_DQ3/M3, SPI0_SCK, SPI0_SCK/M4
net class SD: SD_CD/MIO0, SD_CLK, SD_CMD, SD_D0, SD_D1, SD_D2, SD_D3

### Notes on the sheet
- RESET
- CS pullup
- SDCARD
- SPI/CONF
- Cascaded JTAG
- BOOT MODE
- CONF/LED
- CONF/ USB PHY RST
- (near R37) PLL USED
- USBPHY
- B501@3.3V
- (near R37) B500@3.3V
- BLUETOOTH
- FPGA OUT -> BT IN
- USB
- BT OUT -> FPGA IN
- Title:
- Number:
- Rev.
- Date:
- A4
- Copyright:
- Page
- of
- Filename:

### Library data of the parts
C75 = 24921: as C32 on sheet Analog; Case: 0603 (0201); Tolerance: 20%
D2 = 24212: LED Rot SML-P11UTT86 SMD; AN: 24212; Mixed: SMT; Preferred: Yes; Case: 1005 (0402); HelpURL: B:\AD\adlib\datasheet\SML-P1
D7 = 24211: as D6 on sheet FPGA_B34; Case: 1005 (0402); HelpURL: B:\AD\adlib\datasheet\SML-P1
R6 R51 = 23661: as R8 on sheet DDR3-RAM; Case: 1005 (0402)
R31 = 23160: as R20 on sheet Analog; Case: 1005 (0402)
R32-R34 R36 R38-R40 = 22598: as R5 on sheet A-Headers; Case: 1005 (0402); Value: 12K
R37 = 25021: WID SMD 33R 1% 0,05W; AN: 25021; Value: 33; Mixed: SMT; Preferred: Yes; Case: 0603 (0201); HelpURL: B:\AD\adlib\datasheet\R0201
U5 = 26078: S25FL127SABMFV10 automotive SO8; AN: 26078; Mixed: SMT; Case: SO8W; HelpURL: B:\AD\adlib\datasheet\S25FL12xS

## Sheet FPGA_PWR.SchDoc: TE0723 - FPGA PWR
size A4; PageSetup: Record=PageOptions|CenterHorizontal=True|CenterVertical=True|PrintScale=0.96|XCorrection=1.00|YCorrection=1.00|PrintKind=0|BorderSize=5000000|LeftOffset=0|BottomOffset=0|Orientation=2|PaperLength=1000|PaperWidth=1000|Scale=100|PaperSource=7|PrintQuality=-4|MediaType=1|DitherType=10|PaperKind=A4|PrintScaleMode=1; Organization: Trenz Electronic GmbH; DocumentNumber: TE0723; Revision: 01; SheetNumber: 5; SheetTotal: 12; Date: 08.07.2015; Author: Indrek Tubalkain; CompanyName: Trenz Electronic GmbH; DrawnBy: Indrek Tubalkain; Engineer: Indrek Tubalkain; ProjectName: TE0723 Arduino
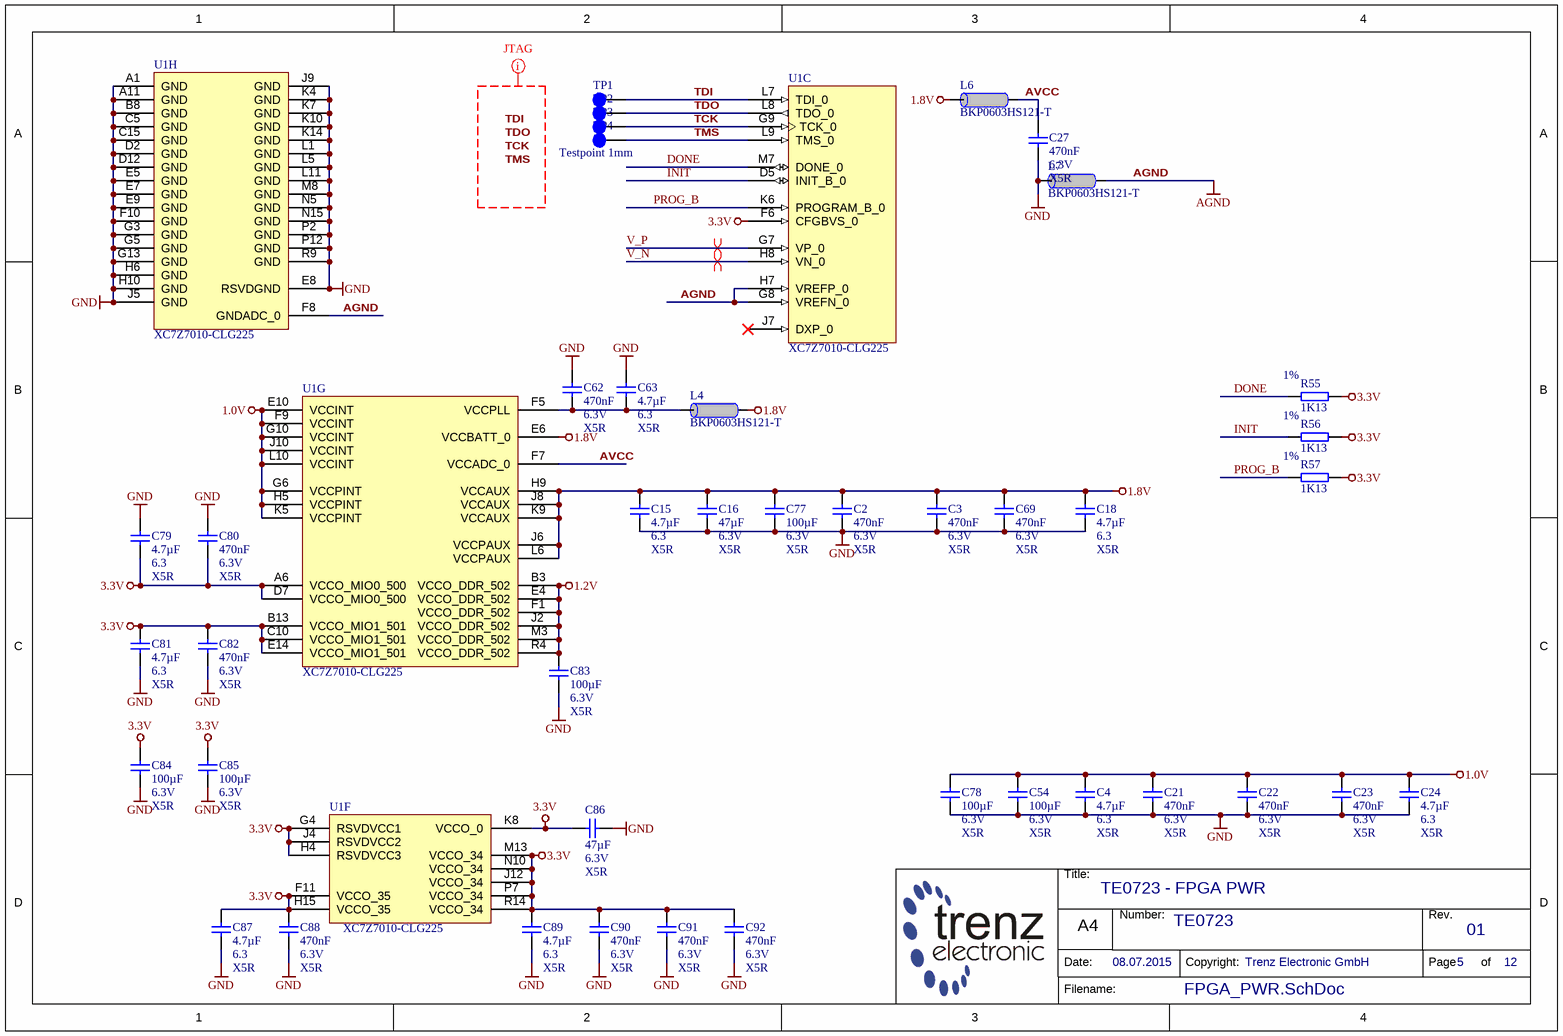
[diagram p7: FPGA_PWR.SchDoc]

### Parts
C2  470nF  Voltage: 6.3V  Technology: X5R  [CAPC0603X33N]
C3  470nF  Voltage: 6.3V  Technology: X5R  [CAPC0603X33N]
C4  4.7µF  Voltage: 6.3  Technology: X5R  [CAPC1005X60N]
C15  4.7µF  Voltage: 6.3  Technology: X5R  [CAPC1005X60N]
C16  47µF  Voltage: 6.3V  Technology: X5R  [CAPC2012X135N]
C18  4.7µF  Voltage: 6.3  Technology: X5R  [CAPC1005X60N]
C21  470nF  Voltage: 6.3V  Technology: X5R  [CAPC0603X33N]
C22  470nF  Voltage: 6.3V  Technology: X5R  [CAPC0603X33N]
C23  470nF  Voltage: 6.3V  Technology: X5R  [CAPC0603X33N]
C24  4.7µF  Voltage: 6.3  Technology: X5R  [CAPC1005X60N]
C27  470nF  Voltage: 6.3V  Technology: X5R  [CAPC0603X33N]
C54  100µF  Voltage: 6.3V  Technology: X5R  [CAPC3216X180N]
C62  470nF  Voltage: 6.3V  Technology: X5R  [CAPC0603X33N]
C63  4.7µF  Voltage: 6.3  Technology: X5R  [CAPC1005X60N]
C69  470nF  Voltage: 6.3V  Technology: X5R  [CAPC0603X33N]
C77  100µF  Voltage: 6.3V  Technology: X5R  [CAPC3216X180N]
C78  100µF  Voltage: 6.3V  Technology: X5R  [CAPC3216X180N]
C79  4.7µF  Voltage: 6.3  Technology: X5R  [CAPC1005X60N]
C80  470nF  Voltage: 6.3V  Technology: X5R  [CAPC0603X33N]
C81  4.7µF  Voltage: 6.3  Technology: X5R  [CAPC1005X60N]
C82  470nF  Voltage: 6.3V  Technology: X5R  [CAPC0603X33N]
C83  100µF  Voltage: 6.3V  Technology: X5R  [CAPC3216X180N]
C84  100µF  Voltage: 6.3V  Technology: X5R  [CAPC3216X180N]
C85  100µF  Voltage: 6.3V  Technology: X5R  [CAPC3216X180N]
C86  47µF  Voltage: 6.3V  Technology: X5R  [CAPC2012X135N]
C87  4.7µF  Voltage: 6.3  Technology: X5R  [CAPC1005X60N]
C88  470nF  Voltage: 6.3V  Technology: X5R  [CAPC0603X33N]
C89  4.7µF  Voltage: 6.3  Technology: X5R  [CAPC1005X60N]
C90  470nF  Voltage: 6.3V  Technology: X5R  [CAPC0603X33N]
C91  470nF  Voltage: 6.3V  Technology: X5R  [CAPC0603X33N]
C92  470nF  Voltage: 6.3V  Technology: X5R  [CAPC0603X33N]
L4  BKP0603HS121-T  [INDC0603X33N]
L6  BKP0603HS121-T  [INDC0603X33N]
L7  BKP0603HS121-T  [INDC0603X33N]
R55  1K13  Tolerance: 1%  [RESC1005X40N]
R56  1K13  Tolerance: 1%  [RESC1005X40N]
R57  1K13  Tolerance: 1%  [RESC1005X40N]
TP1  Testpoint 1mm  [TP_1mm]  (value not drawn)
TP2  Testpoint 1mm  [TP_1mm]  (value not drawn)
TP3  Testpoint 1mm  [TP_1mm]  (value not drawn)
TP4  Testpoint 1mm  [TP_1mm]
U1  XC7Z7010-CLG225  (parts C,F,G,H of 8)

### Nets
1.0V: C4.1 C21.2 C22.2 C23.2 C24.1 C54.1 C78.1 U1.E10(VCCINT) U1.F9(VCCINT) U1.G6(VCCPINT) U1.G10(VCCINT) U1.H5(VCCPINT) U1.J10(VCCINT) U1.K5(VCCPINT) U1.L10(VCCINT)
1.2V: C83.1 U1.B3(VCCO_DDR_502) U1.E4(VCCO_DDR_502) U1.F1(VCCO_DDR_502) U1.J2(VCCO_DDR_502) U1.M3(VCCO_DDR_502) U1.R4(VCCO_DDR_502)
1.8V: C2.2 C3.1 C15.1 C16.1 C18.1 C69.1 C77.1 L4.1 L6.2 U1.E6(VCCBATT_0) U1.H9(VCCAUX) U1.J6(VCCPAUX) U1.J8(VCCAUX) U1.K9(VCCAUX) U1.L6(VCCPAUX)
3.3V: C79.1 C80.2 C81.1 C82.2 C84.1 C85.1 C86.2 C87.1 C88.2 C89.1 C90.2 C91.2 C92.2 R55.2 R56.2 R57.2 U1.A6(VCCO_MIO0_500) U1.B13(VCCO_MIO1_501) U1.C10(VCCO_MIO1_501) U1.D7(VCCO_MIO0_500) U1.E14(VCCO_MIO1_501) U1.F6(CFGBVS_0) U1.F11(VCCO_35) U1.G4(RSVDVCC1) U1.H4(RSVDVCC3) U1.H15(VCCO_35) U1.J4(RSVDVCC2) U1.J12(VCCO_34) U1.K8(VCCO_0) U1.M13(VCCO_34) U1.N10(VCCO_34) U1.P7(VCCO_34) U1.R14(VCCO_34)
AGND: L7.1 U1.F8(GNDADC_0) U1.G8(VREFN_0) U1.H7(VREFP_0)
GND: C2.1 C3.2 C4.2 C15.2 C16.2 C18.2 C21.1 C22.1 C23.1 C24.2 C27.1 C54.2 C62.1 C63.1 C69.2 C77.2 C78.2 C79.2 C80.1 C81.2 C82.1 C83.2 C84.2 C85.2 C86.1 C87.2 C88.1 C89.2 C90.1 C91.1 C92.1 L7.2 U1.A1(GND) U1.A11(GND) U1.B8(GND) U1.C5(GND) U1.C15(GND) U1.D2(GND) U1.D12(GND) U1.E5(GND) U1.E7(GND) U1.E8(RSVDGND) U1.E9(GND) U1.F10(GND) U1.G3(GND) U1.G5(GND) U1.G13(GND) U1.H6(GND) U1.H10(GND) U1.J5(GND) U1.J9(GND) U1.K4(GND) U1.K7(GND) U1.K10(GND) U1.K14(GND) U1.L1(GND) U1.L5(GND) U1.L11(GND) U1.M8(GND) U1.N5(GND) U1.N15(GND) U1.P2(GND) U1.P12(GND) U1.R9(GND)
AVCC: C27.2 L6.1 U1.F7(VCCADC_0)
DONE: R55.1 U1.M7(DONE_0)
INIT: R56.1 U1.D5(INIT_B_0)
PROG_B: R57.1 U1.K6(PROGRAM_B_0)
TCK: TP3.1 U1.G9(TCK_0)
TDI: TP1.1 U1.L7(TDI_0)
TDO: TP2.1 U1.L8(TDO_0)
TMS: TP4.1 U1.L9(TMS_0)
V_N: U1.H8(VN_0)
V_P: U1.G7(VP_0)
NetC62_2: C62.2 C63.2 L4.2 U1.F5(VCCPLL)

Not connected (* = marked no-connect by the designer): U1 J7(DXP_0)*

### Layout directives
net class JTAG: TCK, TDI, TDO, TMS
differential pair: V_N, V_P

### Notes on the sheet
- Labels drawn without touching a wire or pin: TCK, TDI, TDO, TMS
- Title:
- Number:
- Rev.
- Date:
- A4
- Copyright:
- Page
- of
- Filename:

### Library data of the parts
C2 C3 C21-C23 C27 C69 C80 C82 C88 C90-C92 = 24921: as C32 on sheet Analog; Case: 0603 (0201); Tolerance: 20%
C4 C15 C18 C24 C63 C79 C81 C87 C89 = 24719: KON 4.7µF 6.3V X5R SMD 20%; AN: 24719; Mixed: SMT; Value: 4.7u; Preferred: Yes; Case: 1005 (0402); Tolerance: 20%
C16 C86 = 24718: as C93 on sheet A-Headers; Case: 2012 (0805); Tolerance: 20%
C54 C77 C78 C83-C85 = 23116: KON 100µF 6,3V X5R SMD 20%; AN: 23116; Mixed: SMT; Value: 100u; Preferred: Yes; Case: 3216 (1206); Tolerance: 20%
C62 = 24921: as C35 on sheet DDR3-RAM; Case: 0603 (0201); Tolerance: 20%
L4 L6 L7 = 25393: Ferritdurchführung SMD 0201; AN: 25393; Trenz-Stock: Yes; Mixed: SMT; Tolerance: 25%; Case: 0603 (0201); HelpURL: B:\AD\adlib\datasheet\MULTILAYER CHIP BEAD INDUCTORS BK; Preferred: Yes
R55-R57 = 23160: as R20 on sheet Analog; Case: 1005 (0402)
TP1-TP4 = 25063: AN: 25063; Mixed: SMT

## Sheet FPGA_RAM.SchDoc: TE0723 - FPGA RAM
size A4; PageSetup: Record=PageOptions|CenterHorizontal=True|CenterVertical=True|PrintScale=0.96|XCorrection=1.00|YCorrection=1.00|PrintKind=0|BorderSize=5000000|LeftOffset=0|BottomOffset=0|Orientation=2|PaperLength=1000|PaperWidth=1000|Scale=100|PaperSource=7|PrintQuality=-4|MediaType=1|DitherType=10|PaperKind=A4|PrintScaleMode=1; Organization: Trenz Electronic GmbH; DocumentNumber: TE0723; Revision: 01; SheetNumber: 6; SheetTotal: 12; Date: 08.07.2015; Author: Indrek Tubalkain; CompanyName: Trenz Electronic GmbH; DrawnBy: Indrek Tubalkain; Engineer: Indrek Tubalkain; ProjectName: TE0723 Arduino
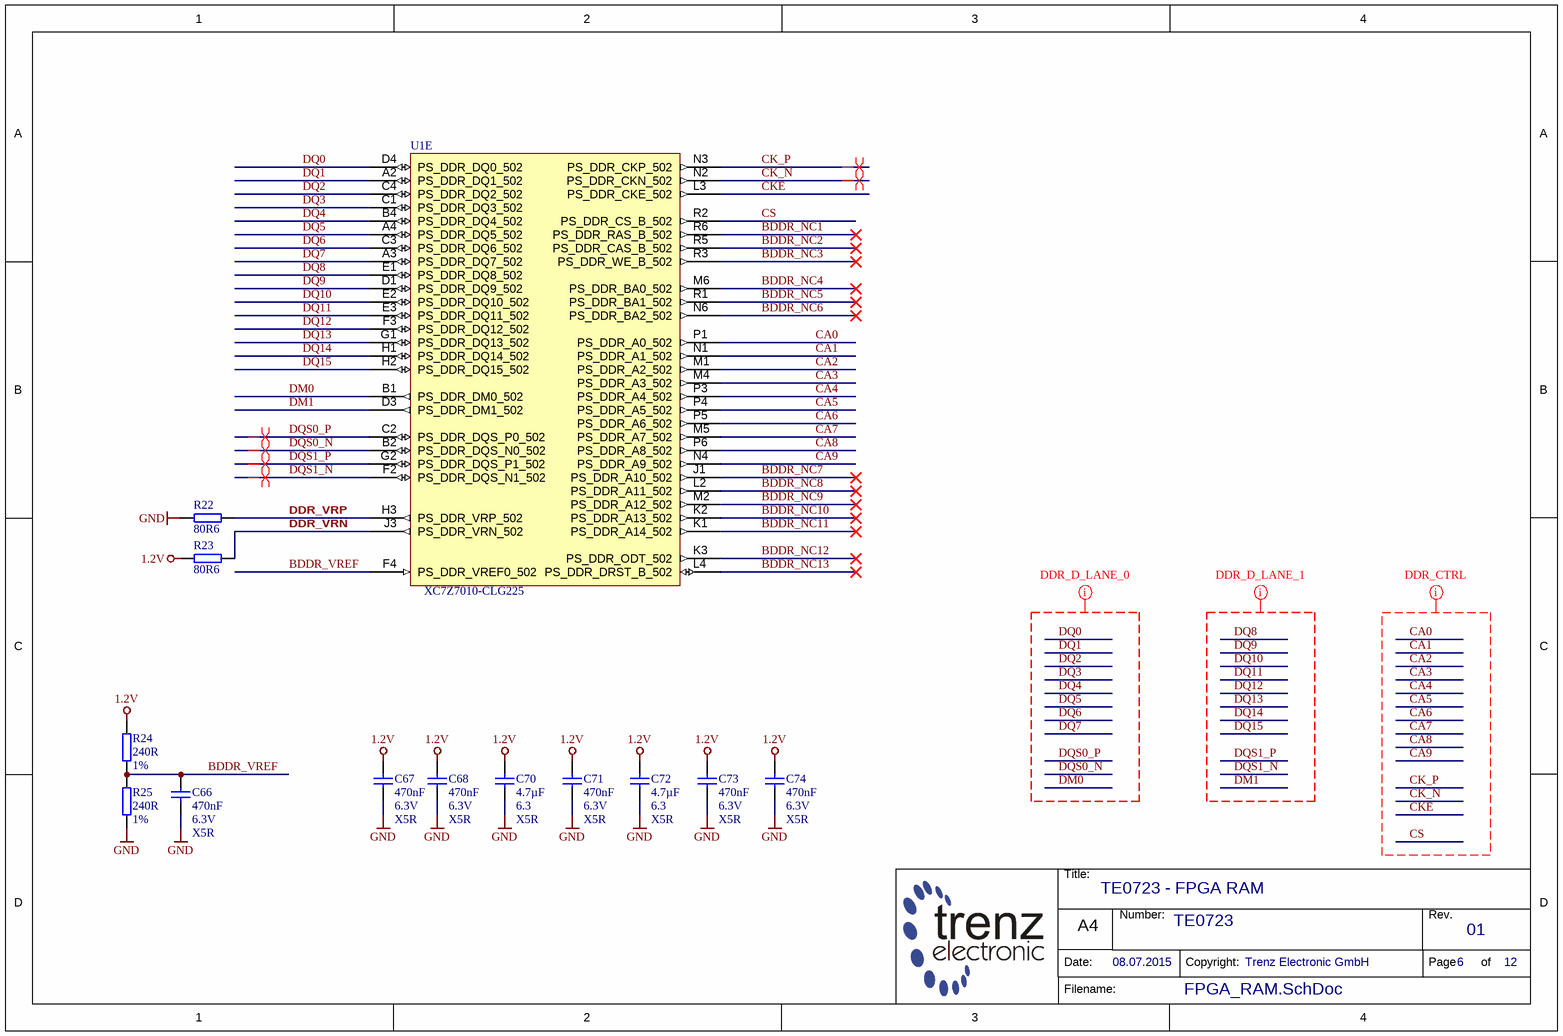
[diagram p8: FPGA_RAM.SchDoc]

### Parts
C66  470nF  Voltage: 6.3V  Technology: X5R  [CAPC0603X33N]
C67  470nF  Voltage: 6.3V  Technology: X5R  [CAPC0603X33N]
C68  470nF  Voltage: 6.3V  Technology: X5R  [CAPC0603X33N]
C70  4.7µF  Voltage: 6.3  Technology: X5R  [CAPC1005X60N]
C71  470nF  Voltage: 6.3V  Technology: X5R  [CAPC0603X33N]
C72  4.7µF  Voltage: 6.3  Technology: X5R  [CAPC1005X60N]
C73  470nF  Voltage: 6.3V  Technology: X5R  [CAPC0603X33N]
C74  470nF  Voltage: 6.3V  Technology: X5R  [CAPC0603X33N]
R22  80R6  [RESC1005X40N]
R23  80R6  [RESC1005X40N]
R24  240R  Tolerance: 1%  [RESC1005X40N]
R25  240R  Tolerance: 1%  [RESC1005X40N]
U1  XC7Z7010-CLG225  (part E of 8)

### Nets
1.2V: C67.1 C68.1 C70.1 C71.2 C72.1 C73.2 C74.1 R23.1 R24.1
GND: C66.2 C67.2 C68.2 C70.2 C71.1 C72.2 C73.1 C74.2 R22.1 R25.2
BDDR_NC1: U1.R6(PS_DDR_RAS_B_502)
BDDR_NC2: U1.R5(PS_DDR_CAS_B_502)
BDDR_NC3: U1.R3(PS_DDR_WE_B_502)
BDDR_NC4: U1.M6(PS_DDR_BA0_502)
BDDR_NC5: U1.R1(PS_DDR_BA1_502)
BDDR_NC6: U1.N6(PS_DDR_BA2_502)
BDDR_NC7: U1.J1(PS_DDR_A10_502)
BDDR_NC8: U1.L2(PS_DDR_A11_502)
BDDR_NC9: U1.M2(PS_DDR_A12_502)
BDDR_NC10: U1.K2(PS_DDR_A13_502)
BDDR_NC11: U1.K1(PS_DDR_A14_502)
BDDR_NC12: U1.K3(PS_DDR_ODT_502)
BDDR_NC13: U1.L4(PS_DDR_DRST_B_502)
BDDR_VREF: C66.1 R24.2 R25.1 U1.F4(PS_DDR_VREF0_502)
CA0: U1.P1(PS_DDR_A0_502)
CA1: U1.N1(PS_DDR_A1_502)
CA2: U1.M1(PS_DDR_A2_502)
CA3: U1.M4(PS_DDR_A3_502)
CA4: U1.P3(PS_DDR_A4_502)
CA5: U1.P4(PS_DDR_A5_502)
CA6: U1.P5(PS_DDR_A6_502)
CA7: U1.M5(PS_DDR_A7_502)
CA8: U1.P6(PS_DDR_A8_502)
CA9: U1.N4(PS_DDR_A9_502)
CK_N: U1.N2(PS_DDR_CKN_502)
CK_P: U1.N3(PS_DDR_CKP_502)
CKE: U1.L3(PS_DDR_CKE_502)
CS: U1.R2(PS_DDR_CS_B_502)
DDR_VRN: R23.2 U1.J3(PS_DDR_VRN_502)
DDR_VRP: R22.2 U1.H3(PS_DDR_VRP_502)
DM0: U1.B1(PS_DDR_DM0_502)
DM1: U1.D3(PS_DDR_DM1_502)
DQ0: U1.D4(PS_DDR_DQ0_502)
DQ1: U1.A2(PS_DDR_DQ1_502)
DQ2: U1.C4(PS_DDR_DQ2_502)
DQ3: U1.C1(PS_DDR_DQ3_502)
DQ4: U1.B4(PS_DDR_DQ4_502)
DQ5: U1.A4(PS_DDR_DQ5_502)
DQ6: U1.C3(PS_DDR_DQ6_502)
DQ7: U1.A3(PS_DDR_DQ7_502)
DQ8: U1.E1(PS_DDR_DQ8_502)
DQ9: U1.D1(PS_DDR_DQ9_502)
DQ10: U1.E2(PS_DDR_DQ10_502)
DQ11: U1.E3(PS_DDR_DQ11_502)
DQ12: U1.F3(PS_DDR_DQ12_502)
DQ13: U1.G1(PS_DDR_DQ13_502)
DQ14: U1.H1(PS_DDR_DQ14_502)
DQ15: U1.H2(PS_DDR_DQ15_502)
DQS0_N: U1.B2(PS_DDR_DQS_N0_502)
DQS0_P: U1.C2(PS_DDR_DQS_P0_502)
DQS1_N: U1.F2(PS_DDR_DQS_N1_502)
DQS1_P: U1.G2(PS_DDR_DQS_P1_502)

### Layout directives
net class DDR_D_LANE_0: DM0, DQ0, DQ1, DQ2, DQ3, DQ4, DQ5, DQ6, DQ7, DQS0_N, DQS0_P
net class DDR_D_LANE_1: DM1, DQ8, DQ9, DQ10, DQ11, DQ12, DQ13, DQ14, DQ15, DQS1_N, DQS1_P
differential pair: CK_N, CK_P, DQS0_N, DQS0_P, DQS1_N, DQS1_P
net class DDR_CTRL: CA0, CA1, CA2, CA3, CA4, CA5, CA6, CA7, CA8, CA9, CK_N, CK_P, CKE, CS

### Notes on the sheet
- Title:
- Number:
- Rev.
- Date:
- A4
- Copyright:
- Page
- of
- Filename:

### Library data of the parts
C66-C68 C74 = 24921: as C35 on sheet DDR3-RAM; Case: 0603 (0201); Tolerance: 20%
C70 C72 = 24719: as C4 on sheet FPGA_PWR; Case: 1005 (0402); Tolerance: 20%
C71 C73 = 24921: as C32 on sheet Analog; Case: 0603 (0201); Tolerance: 20%
R22 R23 = 25100: WID SMD 80R6 1% 0,063W; AN: 25100; Mixed: SMT; Value: 80.6; Preferred: Yes; Tolerance: 1%; Case: 1005 (0402)
R24 R25 = 23661: as R8 on sheet DDR3-RAM; Case: 1005 (0402)

## Sheet FTDI.SchDoc: TE0723 - FTDI
size A4; Organization: Trenz Electronic GmbH; DocumentNumber: TE0723; Revision: 01; SheetNumber: 10; SheetTotal: 12; Date: 08.07.2015; Author: Indrek Tubalkain; CompanyName: Trenz Electronic GmbH; DrawnBy: Indrek Tubalkain; Engineer: Indrek Tubalkain; ProjectName: TE0723 Arduino
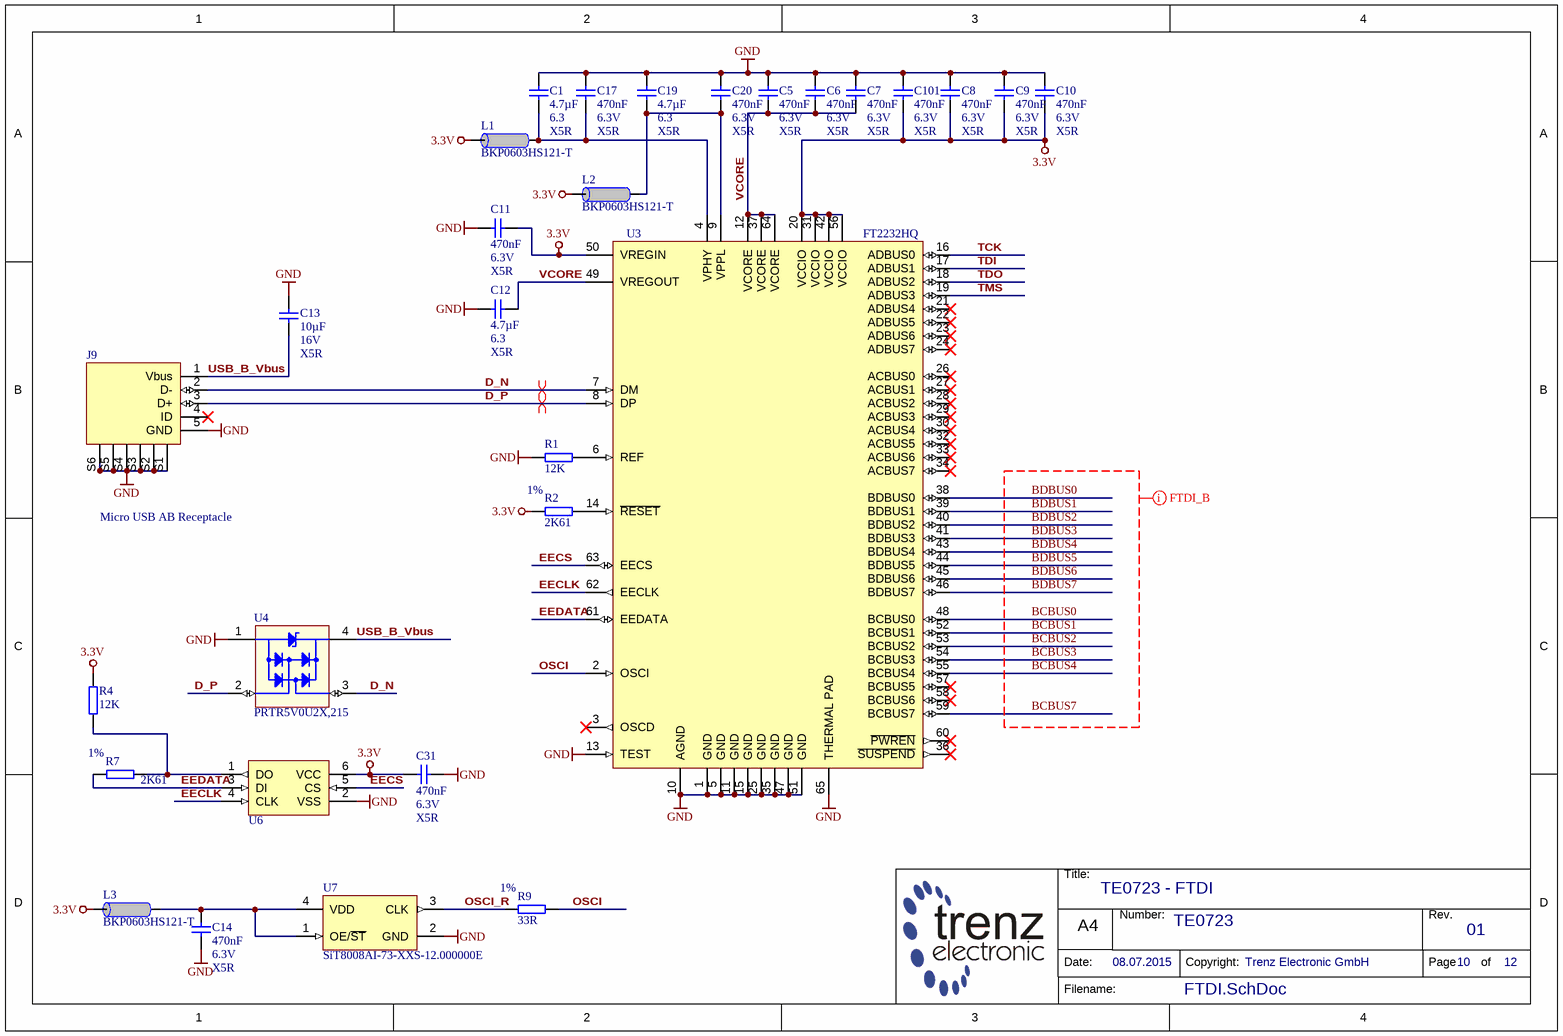
[diagram p9: FTDI.SchDoc]

### Parts
C1  4.7µF  Voltage: 6.3  Technology: X5R  [CAPC1005X60N]
C5  470nF  Voltage: 6.3V  Technology: X5R  [CAPC0603X33N]
C6  470nF  Voltage: 6.3V  Technology: X5R  [CAPC0603X33N]
C7  470nF  Voltage: 6.3V  Technology: X5R  [CAPC0603X33N]
C8  470nF  Voltage: 6.3V  Technology: X5R  [CAPC0603X33N]
C9  470nF  Voltage: 6.3V  Technology: X5R  [CAPC0603X33N]
C10  470nF  Voltage: 6.3V  Technology: X5R  [CAPC0603X33N]
C11  470nF  Voltage: 6.3V  Technology: X5R  [CAPC0603X33N]
C12  4.7µF  Voltage: 6.3  Technology: X5R  [CAPC1005X60N]
C13  10µF  Voltage: 16V  Technology: X5R  [CAPC1608X90N]
C14  470nF  Voltage: 6.3V  Technology: X5R  [CAPC0603X33N]
C17  470nF  Voltage: 6.3V  Technology: X5R  [CAPC0603X33N]
C19  4.7µF  Voltage: 6.3  Technology: X5R  [CAPC1005X60N]
C20  470nF  Voltage: 6.3V  Technology: X5R  [CAPC0603X33N]
C31  470nF  Voltage: 6.3V  Technology: X5R  [CAPC0603X33N]
C101  470nF  Voltage: 6.3V  Technology: X5R  [CAPC0603X33N]
J9  Micro USB AB Receptacle  [Micro USB ZX62-xx-5PA]
L1  BKP0603HS121-T  [INDC0603X33N]
L2  BKP0603HS121-T  [INDC0603X33N]
L3  BKP0603HS121-T  [INDC0603X33N]
R1  12K  [RESC1005X40N]
R2  2K61  Tolerance: 1%  [RESC1005X40N]
R4  12K  [RESC1005X40N]
R7  2K61  Tolerance: 1%  [RESC1005X40N]
R9  33R  Tolerance: 1%  [RESC0603X26N]
U3  FT2232HQ  [QFN50P900X900X100-65N-445]
U4  PRTR5V0U2X,215  [SOT190P229X114-4N]
U6  93AA56BT-I/OT  [SOT95P280X145-6N]  (value not drawn)
U7  SiT8008AI-73-XXS-12.000000E  [2016]

### Nets
3.3V: C8.1 C9.1 C10.1 C11.2 C31.1 C101.1 L1.2 L2.2 L3.2 R2.1 R4.2 U3.20(VCCIO) U3.31(VCCIO) U3.42(VCCIO) U3.50(VREGIN) U3.56(VCCIO) U6.6(VCC)
GND: C1.2 C5.2 C6.2 C7.2 C8.2 C9.2 C10.2 C11.1 C12.1 C13.1 C14.1 C17.2 C19.2 C20.2 C31.2 C101.2 J9.5(GND) J9.S1 J9.S2 J9.S3 J9.S4 J9.S5 J9.S6 R1.1 U3.1(GND) U3.5(GND) U3.10(AGND) U3.11(GND) U3.13(TEST) U3.15(GND) U3.25(GND) U3.35(GND) U3.47(GND) U3.51(GND) U3.65(THERMAL_PAD) U4.1(GND) U6.2(VSS) U7.2(GND)
BCBUS0: U3.48(BCBUS0)
BCBUS1: U3.52(BCBUS1)
BCBUS2: U3.53(BCBUS2)
BCBUS3: U3.54(BCBUS3)
BCBUS4: U3.55(BCBUS4)
BCBUS7: U3.59(BCBUS7)
BDBUS0: U3.38(BDBUS0)
BDBUS1: U3.39(BDBUS1)
BDBUS2: U3.40(BDBUS2)
BDBUS3: U3.41(BDBUS3)
BDBUS4: U3.43(BDBUS4)
BDBUS5: U3.44(BDBUS5)
BDBUS6: U3.45(BDBUS6)
BDBUS7: U3.46(BDBUS7)
D_N: J9.2(D-) U3.7(DM) U4.3(I/O)
D_P: J9.3(D+) U3.8(DP) U4.2(I/O)
EECLK: U3.62(EECLK) U6.4(CLK)
EECS: U3.63(EECS) U6.5(CS)
EEDATA: R7.1 U3.61(EEDATA) U6.3(DI)
OSCI: R9.2 U3.2(OSCI)
OSCI_R: R9.1 U7.3(CLK)
TCK: U3.16(ADBUS0)
TDI: U3.17(ADBUS1)
TDO: U3.18(ADBUS2)
TMS: U3.19(ADBUS3)
USB_B_Vbus: C13.2 J9.1(Vbus) U4.4(REF)
VCORE: C5.1 C6.1 C7.1 C12.2 U3.12(VCORE) U3.37(VCORE) U3.49(VREGOUT) U3.64(VCORE)
NetC1_1: C1.1 C17.1 L1.1 U3.4(VPHY)
NetC14_2: C14.2 L3.1 U7.1(OE/~{ST}) U7.4(VDD)
NetC19_1: C19.1 C20.1 L2.1 U3.9(VPPL)
NetR1_2: R1.2 U3.6(REF)
NetR2_2: R2.2 U3.14(~{RESET})
NetR4_1: R4.1 R7.2 U6.1(DO)

Not connected (* = marked no-connect by the designer): J9 4(ID)*; U3 3(OSCD)* 21(ADBUS4)* 22(ADBUS5)* 23(ADBUS6)* 24(ADBUS7)* 26(ACBUS0)* 27(ACBUS1)* 28(ACBUS2)* 29(ACBUS3)* 30(ACBUS4)* 32(ACBUS5)* 33(ACBUS6)* 34(ACBUS7)* 36(~{SUSPEND})* 57(BCBUS5)* 58(BCBUS6)* 60(~{PWREN})*

### Layout directives
differential pair: D_N, D_P
net class FTDI_B: BCBUS0, BCBUS1, BCBUS2, BCBUS3, BCBUS4, BCBUS7, BDBUS0, BDBUS1, BDBUS2, BDBUS3, BDBUS4, BDBUS5, BDBUS6, BDBUS7

### Notes on the sheet
- Title:
- Number:
- Rev.
- Date:
- A4
- Copyright:
- Page
- of
- Filename:

### Library data of the parts
C1 C12 C19 = 24719: as C4 on sheet FPGA_PWR; Case: 1005 (0402); Tolerance: 20%
C5-C11 C14 C17 C20 C31 C101 = 24921: as C32 on sheet Analog; Case: 0603 (0201); Tolerance: 20%
C13 = 25341: as C34 on sheet Analog; Case: 1608 (0603); Tolerance: 20%
J9 = 25126: Micro USB AB Buchse; AN: 25126; Mixed: SMT; Trenz-Stock: Yes; Case: Micro USB AB; HelpURL: B:\AD\adlib\datasheet\USB\USB_2.0_Spec\Micro-USB_final
L1-L3 = 25393: as L8 on sheet Analog; Case: 0603 (0201); HelpURL: B:\AD\adlib\datasheet\MULTILAYER CHIP BEAD INDUCTORS BK; Preferred: Yes
R1 R4 = 22598: as R5 on sheet A-Headers; Case: 1005 (0402); Value: 12K
R2 R7 = 23730: as R19 on sheet Analog; Case: 1005 (0402)
R9 = 25021: as R12 on sheet A-Headers; Case: 0603 (0201); HelpURL: B:\AD\adlib\datasheet\R0201
U3 = 24727: AN: 24727; Trenz-Stock: Yes; Mixed: SMT; Case: QFN64; HelpURL: B:\AD\adlib\datasheet\FT2232H; Preferred: Yes
U4 = 24840: AN: 24840; Mixed: SMT; Preferred: Yes; Case: SOT143; HelpURL: B:\AD\adlib\datasheet\CD143A-SR05
U6 = 24730: AN: 24730; Trenz-Stock: Yes; Mixed: SMT; Case: SOT23-6; HelpURL: B:\AD\adlib\datasheet\93AA56A; Preferred: Yes
U7 = 25325: SiT8008AI-73-XXS-12.000000E MEMS Oszillator 12MHz; AN: 25325; Value: 12M; Trenz-Stock: Yes; Mixed: SMT; Case: 2.0  x 1.6mm; HelpURL: B:\AD\adlib\datasheet\SiT8008; Preferred: Yes

## Sheet PowerSupply.SchDoc: TE0723 - PowerSupply
size A4; PageSetup: Record=PageOptions|CenterHorizontal=True|CenterVertical=True|PrintScale=0.96|XCorrection=1.00|YCorrection=1.00|PrintKind=0|BorderSize=5000000|LeftOffset=0|BottomOffset=0|Orientation=2|PaperLength=1000|PaperWidth=1000|Scale=100|PaperSource=7|PrintQuality=-4|MediaType=1|DitherType=10|PaperKind=A4|PrintScaleMode=1; Organization: Trenz Electronic GmbH; DocumentNumber: TE0723; Revision: 01; SheetNumber: 11; SheetTotal: 12; Date: 08.07.2015; Author: Indrek Tubalkain; CompanyName: Trenz Electronic GmbH; DrawnBy: Indrek Tubalkain; Engineer: Indrek Tubalkain; ProjectName: TE0723 Arduino
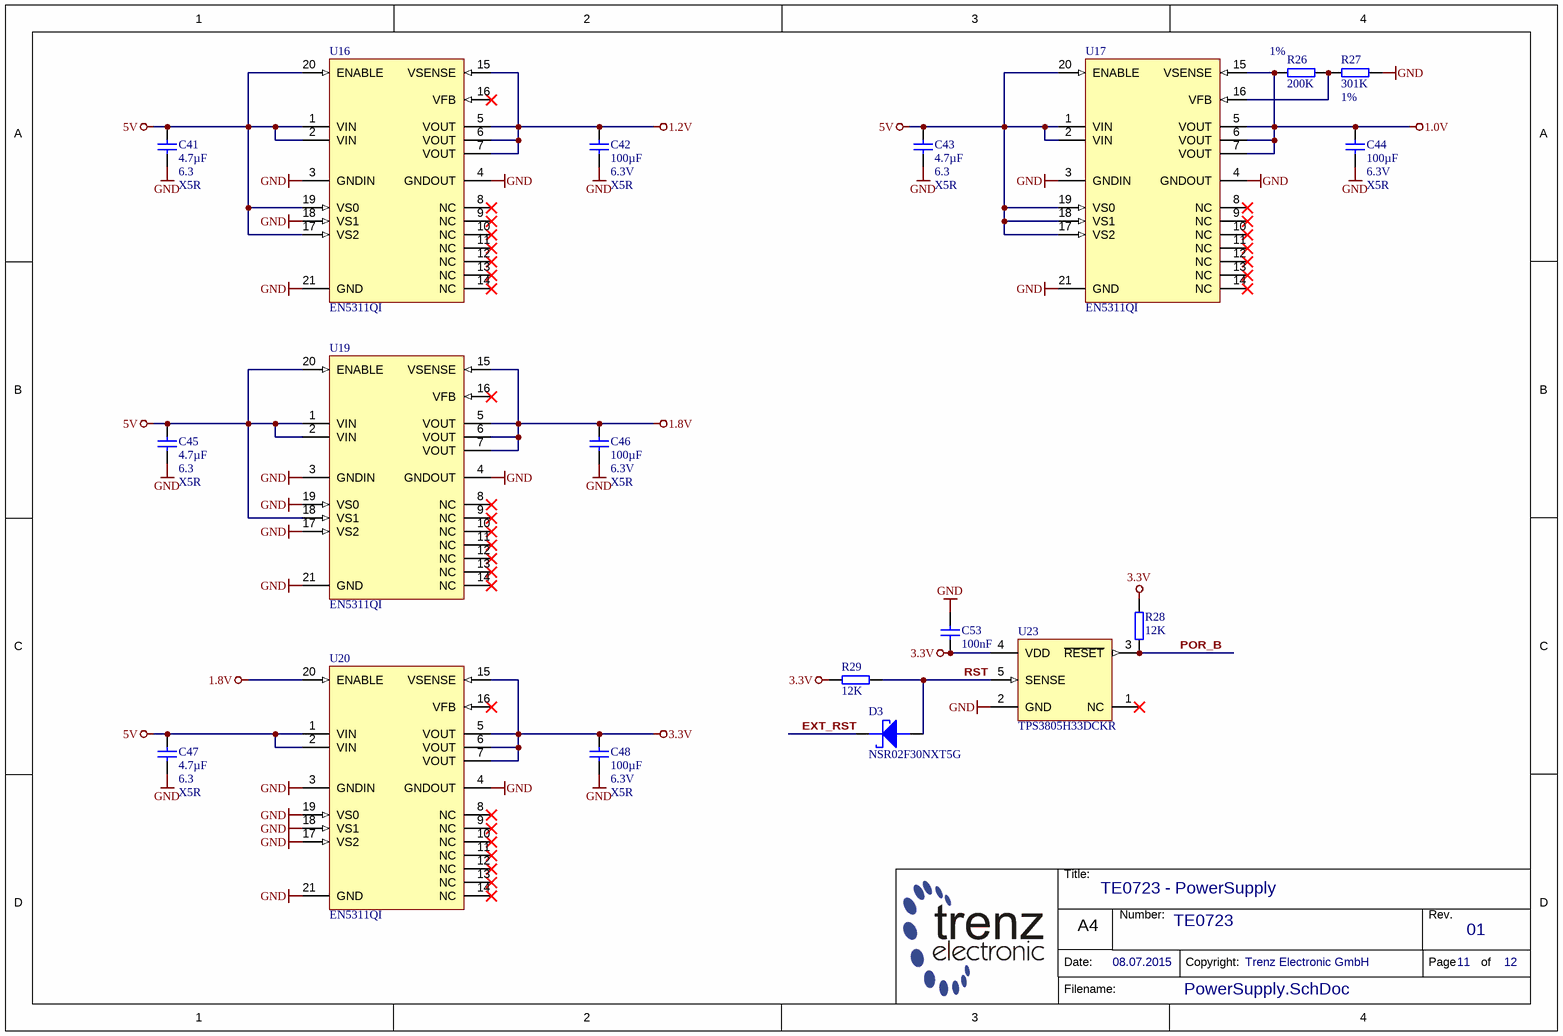
[diagram p10: PowerSupply.SchDoc]

### Parts
C41  4.7µF  Voltage: 6.3  Technology: X5R  [CAPC1005X60N]
C42  100µF  Voltage: 6.3V  Technology: X5R  [CAPC3216X180N]
C43  4.7µF  Voltage: 6.3  Technology: X5R  [CAPC1005X60N]
C44  100µF  Voltage: 6.3V  Technology: X5R  [CAPC3216X180N]
C45  4.7µF  Voltage: 6.3  Technology: X5R  [CAPC1005X60N]
C46  100µF  Voltage: 6.3V  Technology: X5R  [CAPC3216X180N]
C47  4.7µF  Voltage: 6.3  Technology: X5R  [CAPC1005X60N]
C48  100µF  Voltage: 6.3V  Technology: X5R  [CAPC3216X180N]
C53  100nF  [CAPC1005X55N]
D3  NSR02F30NXT5G  [DIOC0603X30N]
R26  200K  Tolerance: 1%  [RESC1005X40N]
R27  301K  Tolerance: 1%  [RESC1005X40N]
R28  12K  [RESC1005X40N]
R29  12K  [RESC1005X40N]
U16  EN5311QI  [EN5311QI]
U17  EN5311QI  [EN5311QI]
U19  EN5311QI  [EN5311QI]
U20  EN5311QI  [EN5311QI]
U23  TPS3805H33DCKR  [SOT65P210X110-5N]

### Nets
1.0V: C44.1 R26.1 U17.5(VOUT) U17.6(VOUT) U17.7(VOUT) U17.15(VSENSE)
1.2V: C42.1 U16.5(VOUT) U16.6(VOUT) U16.7(VOUT) U16.15(VSENSE)
1.8V: C46.1 U19.5(VOUT) U19.6(VOUT) U19.7(VOUT) U19.15(VSENSE) U20.20(ENABLE)
3.3V: C48.1 C53.2 R28.2 R29.2 U20.5(VOUT) U20.6(VOUT) U20.7(VOUT) U20.15(VSENSE) U23.4(VDD)
5V: C41.1 C43.1 C45.1 C47.1 U16.1(VIN) U16.2(VIN) U16.17(VS2) U16.19(VS0) U16.20(ENABLE) U17.1(VIN) U17.2(VIN) U17.17(VS2) U17.18(VS1) U17.19(VS0) U17.20(ENABLE) U19.1(VIN) U19.2(VIN) U19.18(VS1) U19.20(ENABLE) U20.1(VIN) U20.2(VIN)
GND: C41.2 C42.2 C43.2 C44.2 C45.2 C46.2 C47.2 C48.2 C53.1 R27.2 U16.3(GNDIN) U16.4(GNDOUT) U16.18(VS1) U16.21(GND) U17.3(GNDIN) U17.4(GNDOUT) U17.21(GND) U19.3(GNDIN) U19.4(GNDOUT) U19.17(VS2) U19.19(VS0) U19.21(GND) U20.3(GNDIN) U20.4(GNDOUT) U20.17(VS2) U20.18(VS1) U20.19(VS0) U20.21(GND) U23.2(GND)
EXT_RST: D3.1(KATHODE)
POR_B: R28.1 U23.3(~{RESET})
RST: D3.2(ANODE) R29.1 U23.5(SENSE)
NetR26_2: R26.2 R27.1 U17.16(VFB)

Not connected (* = marked no-connect by the designer): U16 8(NC)* 9(NC)* 10(NC)* 11(NC)* 12(NC)* 13(NC)* 14(NC)* 16(VFB)*; U17 8(NC)* 9(NC)* 10(NC)* 11(NC)* 12(NC)* 13(NC)* 14(NC)*; U19 8(NC)* 9(NC)* 10(NC)* 11(NC)* 12(NC)* 13(NC)* 14(NC)* 16(VFB)*; U20 8(NC)* 9(NC)* 10(NC)* 11(NC)* 12(NC)* 13(NC)* 14(NC)* 16(VFB)*; U23 1(NC)*

### Notes on the sheet
- Title:
- Number:
- Rev.
- Date:
- A4
- Copyright:
- Page
- of
- Filename:

### Library data of the parts
C41 C43 C45 C47 = 24719: as C4 on sheet FPGA_PWR; Case: 1005 (0402); Tolerance: 20%
C42 C44 C46 C48 = 23116: as C54 on sheet FPGA_PWR; Case: 3216 (1206); Tolerance: 20%
C53 = 26183: KON 100nF 50V SMD AEC-Q200; AN: 26183; Tolerance: 10%; Mixed: SMT; Value: 100n; Case: 1005 (0402); Voltage: 50V; Technology: X7R
D3 = 26175: AN: 26175; Mixed: SMT; Trenz-Stock: Yes; Case: DSN2 - 0201; HelpURL: B:\ad\adlib\datasheet\NSR02F30NXT5G
R26 = 23846: WID SMD 200K 1% 0,063W; AN: 23846; Mixed: SMT; Preferred: Yes; Case: 1005 (0402); Value: 200K
R27 = 26224: WID SMD 301K 1% 0,063W; AN: 26224; Mixed: SMT; Case: 1005 (0402); Value: 301k
R28 R29 = 22598: as R5 on sheet A-Headers; Case: 1005 (0402); Value: 12K
U16 U17 U19 U20 = 25492: AN: 25492; Mixed: SMT; Trenz-Stock: Yes; Case: QFN20; HelpURL: B:\AD\adlib\datasheet\EN5311QI; Preferred: Yes
U23 = 25049: AN: 25049; Mixed: SMT; Trenz-Stock: Yes; Case: SC70-5 / SC88A / SOT353; HelpURL: B:\AD\adlib\datasheet\TPS3805H33; Preferred: Yes

## Sheet USB-PHY.SchDoc: TE0723 - USB
size A4; Organization: Trenz Electronic GmbH; DocumentNumber: TE0723; Revision: 01; SheetNumber: 9; SheetTotal: 12; Date: 08.07.2015; Author: Indrek Tubalkain; CompanyName: Trenz Electronic GmbH; DrawnBy: Indrek Tubalkain; Engineer: Indrek Tubalkain; ProjectName: TE0723 Arduino
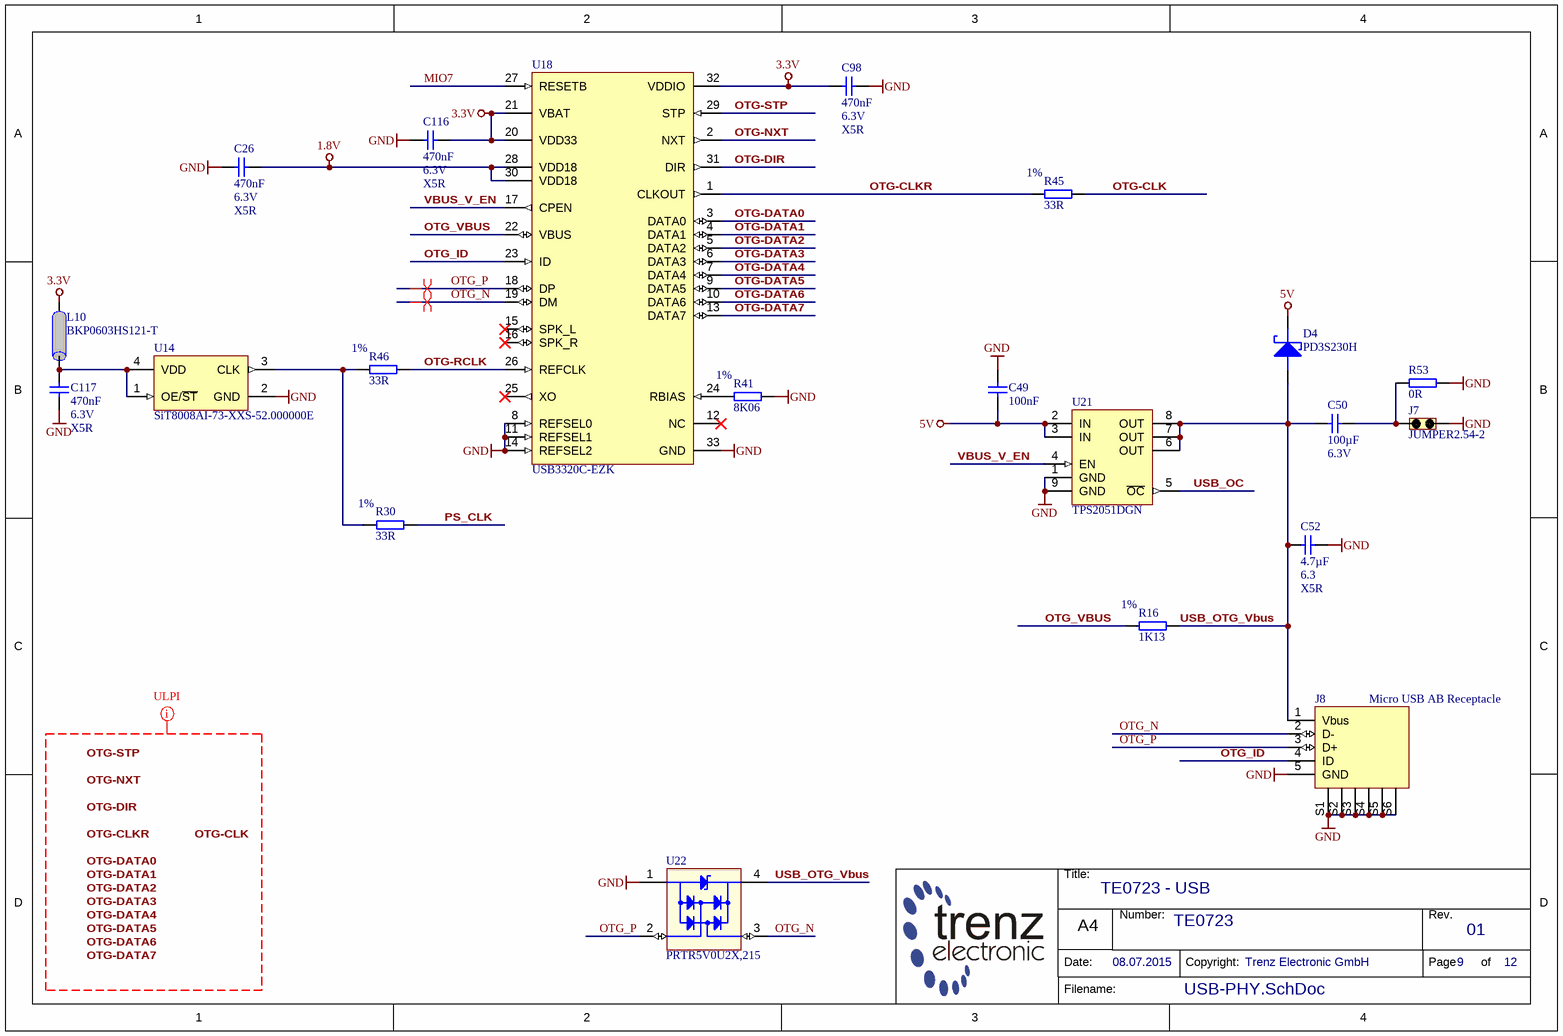
[diagram p11: USB-PHY.SchDoc]

### Parts
C26  470nF  Voltage: 6.3V  Technology: X5R  [CAPC0603X33N]
C49  100nF  [CAPC1005X55N]
C50  100µF  Voltage: 6.3V  [CAPC3216X180N]
C52  4.7µF  Voltage: 6.3  Technology: X5R  [CAPC1005X60N]
C98  470nF  Voltage: 6.3V  Technology: X5R  [CAPC0603X33N]
C116  470nF  Voltage: 6.3V  Technology: X5R  [CAPC0603X33N]
C117  470nF  Voltage: 6.3V  Technology: X5R  [CAPC0603X33N]
D4  PD3S230H  [PowerDI323]
J7  JUMPER2.54-2  [JUMPER2_54-2]
J8  Micro USB AB Receptacle  [Micro USB ZX62-xx-5PA]
L10  BKP0603HS121-T  [INDC0603X33N]
R16  1K13  Tolerance: 1%  [RESC1005X40N]
R30  33R  Tolerance: 1%  [RESC0603X26N]
R41  8K06  Tolerance: 1%  [RESC1005X40N]
R45  33R  Tolerance: 1%  [RESC0603X26N]
R46  33R  Tolerance: 1%  [RESC0603X26N]
R53  0R  [RESC1005X40N]
U14  SiT8008AI-73-XXS-52.000000E  [2016]
U18  USB3320C-EZK  [QFN50P500X500X100-33N-345]
U21  TPS2051DGN  [SOP65P488X107-9N-TI]
U22  PRTR5V0U2X,215  [SOT190P229X114-4N]

### Nets
1.8V: C26.1 U18.28(VDD18) U18.30(VDD18)
3.3V: C98.2 C116.1 L10.1 U18.20(VDD33) U18.21(VBAT) U18.32(VDDIO)
5V: C49.2 D4.1(KATHODE) U21.2(IN) U21.3(IN)
GND: C26.2 C49.1 C52.2 C98.1 C116.2 C117.2 J7.2 J8.5(GND) J8.S1 J8.S2 J8.S3 J8.S4 J8.S5 J8.S6 R41.2 R53.2 U14.2(GND) U18.8(REFSEL0) U18.11(REFSEL1) U18.14(REFSEL2) U18.33(GND) U21.1(GND) U21.9(GND) U22.1(GND)
MIO7: U18.27(RESETB)
OTG-CLK: R45.2
OTG-CLKR: R45.1 U18.1(CLKOUT)
OTG-DATA0: U18.3(DATA0)
OTG-DATA1: U18.4(DATA1)
OTG-DATA2: U18.5(DATA2)
OTG-DATA3: U18.6(DATA3)
OTG-DATA4: U18.7(DATA4)
OTG-DATA5: U18.9(DATA5)
OTG-DATA6: U18.10(DATA6)
OTG-DATA7: U18.13(DATA7)
OTG-DIR: U18.31(DIR)
OTG-NXT: U18.2(NXT)
OTG-RCLK: R46.2 U18.26(REFCLK)
OTG-STP: U18.29(STP)
OTG_ID: J8.4(ID) U18.23(ID)
OTG_N: J8.2(D-) U18.19(DM) U22.3(I/O)
OTG_P: J8.3(D+) U18.18(DP) U22.2(I/O)
OTG_VBUS: R16.1 U18.22(VBUS)
PS_CLK: R30.2
USB_OC: U21.5(~{OC})
USB_OTG_Vbus: C50.2 C52.1 D4.2(ANODE) J8.1(Vbus) R16.2 U21.6(OUT) U21.7(OUT) U21.8(OUT) U22.4(REF)
VBUS_V_EN: U18.17(CPEN) U21.4(EN)
NetC50_1: C50.1 J7.1 R53.1
NetC117_1: C117.1 L10.2 U14.1(OE/~{ST}) U14.4(VDD)
NetR30_1: R30.1 R46.1 U14.3(CLK)
NetR41_1: R41.1 U18.24(RBIAS)

Not connected (* = marked no-connect by the designer): U18 12(NC)* 15(SPK_L)* 16(SPK_R)* 25(XO)*

### Layout directives
differential pair: OTG_N, OTG_P
net class ULPI: OTG-CLK, OTG-CLKR, OTG-DATA0, OTG-DATA1, OTG-DATA2, OTG-DATA3, OTG-DATA4, OTG-DATA5, OTG-DATA6, OTG-DATA7, OTG-DIR, OTG-NXT, OTG-STP

### Notes on the sheet
- Labels drawn without touching a wire or pin: OTG-CLK, OTG-CLKR, OTG-DATA0, OTG-DATA1, OTG-DATA2, OTG-DATA3, OTG-DATA4, OTG-DATA5, OTG-DATA6, OTG-DATA7, OTG-DIR, OTG-NXT, OTG-STP
- Title:
- Number:
- Rev.
- Date:
- A4
- Copyright:
- Page
- of
- Filename:

### Library data of the parts
C26 C98 C116 C117 = 24921: as C32 on sheet Analog; Case: 0603 (0201); Tolerance: 20%
C49 = 26183: as C53 on sheet PowerSupply; Case: 1005 (0402); Voltage: 50V; Technology: X7R
C50 = 23116: as C54 on sheet FPGA_PWR; Technology: X5R; Case: 3216 (1206); Tolerance: 20%
C52 = 24719: as C4 on sheet FPGA_PWR; Case: 1005 (0402); Tolerance: 20%
D4 = 24682: AN: 24682; Mixed: SMT; Case: PowerDI323; HelpURL: B:\AD\adlib\datasheet\PD3S230H
J7 = 22330: Stiftleiste gerade 1-reihig, 2pol.; AN: 22330; Mixed: THT; Trenz-Stock: Yes
J8 = 25126: as J9 on sheet FTDI; Case: Micro USB AB; HelpURL: B:\AD\adlib\datasheet\USB\USB_2.0_Spec\Micro-USB_final
L10 = 25393: as L8 on sheet Analog; Case: 0603 (0201); HelpURL: B:\AD\adlib\datasheet\MULTILAYER CHIP BEAD INDUCTORS BK; Preferred: Yes
R16 = 23160: as R20 on sheet Analog; Case: 1005 (0402)
R30 R45 R46 = 25021: as R37 on sheet FPGA_MIO; Case: 0603 (0201); HelpURL: B:\AD\adlib\datasheet\R0201
R41 = 25052: WID SMD 8K06 1% 0,063W; AN: 25052; Value: 8.06K; Mixed: SMT; Preferred: Yes; Case: 1005 (0402)
R53 = 26222: as R21 on sheet Analog; Case: 1005 (0402)
U14 = 25009: SiT8008AI-73-XXS-52.000000E MEMS Oszillator 52MHz; AN: 25009; Value: 52M; Trenz-Stock: Yes; Mixed: SMT; Case: 2.0  x 1.6mm; HelpURL: B:\AD\adlib\datasheet\SiT8008; Preferred: Yes
U18 = 24992: AN: 24992; Trenz-Stock: Yes; Mixed: SMT; Case: QFN32; HelpURL: B:\AD\adlib\datasheet\USB3320
U21 = 25167: TPS2051BDGN; AN: 25167; Trenz-Stock: Yes; Mixed: SMT; HelpURL: B:\AD\adlib\datasheet\TPS2051BDGN; Preferred: Yes
U22 = 24840: AN: 24840; Mixed: SMT; Preferred: Yes; Case: SOT143; HelpURL: B:\AD\adlib\datasheet\CD143A-SR05